# EAGLE design Gamer (EAGLE 7.1.0)

## Sheet 1 of 5
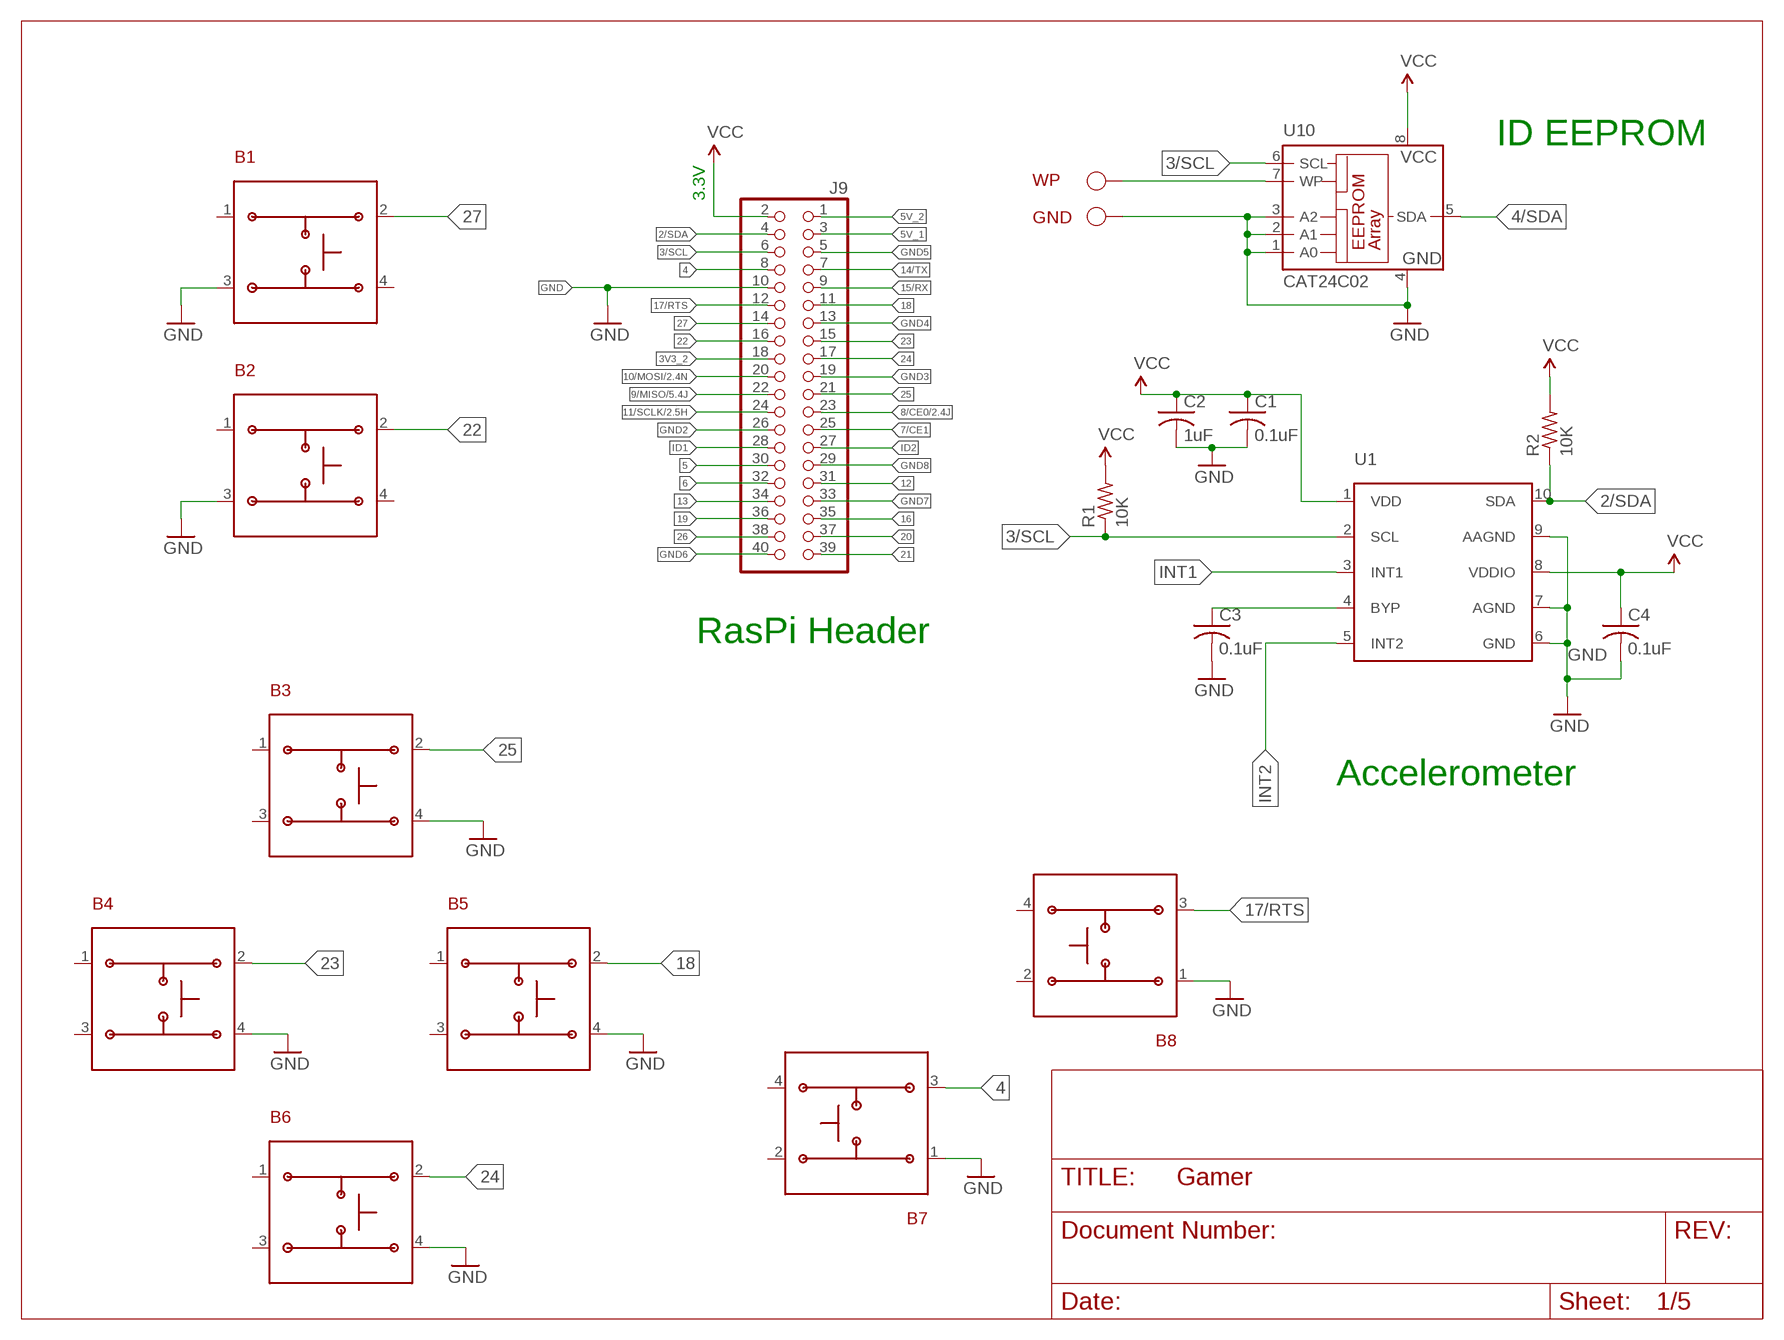
[diagram p0: schematic, sheet 1]

### Parts
B1  6X6MM_BUTTON  [6X6MM_BUTTON]
B2  6X6MM_BUTTON  [6X6MM_BUTTON]
B3  12X12MM_BUTTON  [12X12MM_BUTTON]
B4  12X12MM_BUTTON  [12X12MM_BUTTON]
B5  12X12MM_BUTTON  [12X12MM_BUTTON]
B6  12X12MM_BUTTON  [12X12MM_BUTTON]
B7  12X12MM_BUTTON  [12X12MM_BUTTON]
B8  12X12MM_BUTTON  [12X12MM_BUTTON]
C1  0.1uF  C-USC0603  [C0603]
C2  1uF  C-USC0603  [C0603]
C3  0.1uF  C-USC0603  [C0603]
C4  0.1uF  C-USC0603  [C0603]
GND  TESTPAD  [TESTPAD]
J9  PINHD-2X20  [2X20]
R1  10K  R-US_R0603  [R0603]
R2  10K  R-US_R0603  [R0603]
U1  MMA8653FCR1  [MMA8653FCR1]
U10  CAT24C02  24LC64ST  [TSSOP8]
WP  TESTPAD  [TESTPAD]

### Nets
2/SDA: J9.4 R2.1 U1.10(SDA)
3/SCL: J9.6 R1.1 U1.2(SCL) U10.6(SCL)
3V3_2: J9.18
4: B7.3 J9.8
4/SDA: U10.5(SDA)
5: J9.30
5V_1: J9.3
5V_2: J9.1
6: J9.32
7/CE1: J9.25
8/CE0: J9.23 ; also sheet 2,3,4,5
9/MISO: J9.22 ; also sheet 5
10/MOSI: J9.20 ; also sheet 2
11/SCLK: J9.24 ; also sheet 2,3,4,5
12: J9.31
13: J9.34
14/TX: J9.7
15/RX: J9.9
16: J9.35
17/RTS: B8.3 J9.12
18: B5.2 J9.11
19: J9.36
20: J9.37
21: J9.39
22: B2.2 J9.16
23: B4.2 J9.15
24: B6.2 J9.17
25: B3.2 J9.21
26: J9.38
27: B1.2 J9.14
GND: B1.3 B2.3 B3.4 B4.4 B5.4 B6.4 B7.1 B8.1 C1.2 C2.2 C3.2 C4.2 GND.1 J9.10 U1.6(GND) U1.7(AGND) U1.9(AAGND) U10.1(A0) U10.2(A1) U10.3(A2) U10.4(GND) ; also sheet 2,3,4,5
GND2: J9.26
GND3: J9.19
GND4: J9.13
GND5: J9.5
GND6: J9.40
GND7: J9.33
GND8: J9.29
ID1: J9.28
ID2: J9.27
INT1: U1.3(INT1)
INT2: U1.5(INT2)
N$1: U10.7(WP) WP.1
N$34: C3.1 U1.4(BYP)
VCC: C1.1 C2.1 C4.1 J9.2 R1.2 R2.2 U1.1(VDD) U1.8(VDDIO) U10.8(VCC) ; also sheet 2,3,4,5
Unconnected: B1.1 B1.4 B2.1 B2.4 B3.1 B3.3 B4.1 B4.3 B5.1 B5.3 B6.1 B6.3 B7.2 B7.4 B8.2 B8.4

### Notes on the sheet
- ID EEPROM
- 3.3V
- RasPi Header
- Accelerometer

## Sheet 2 of 5
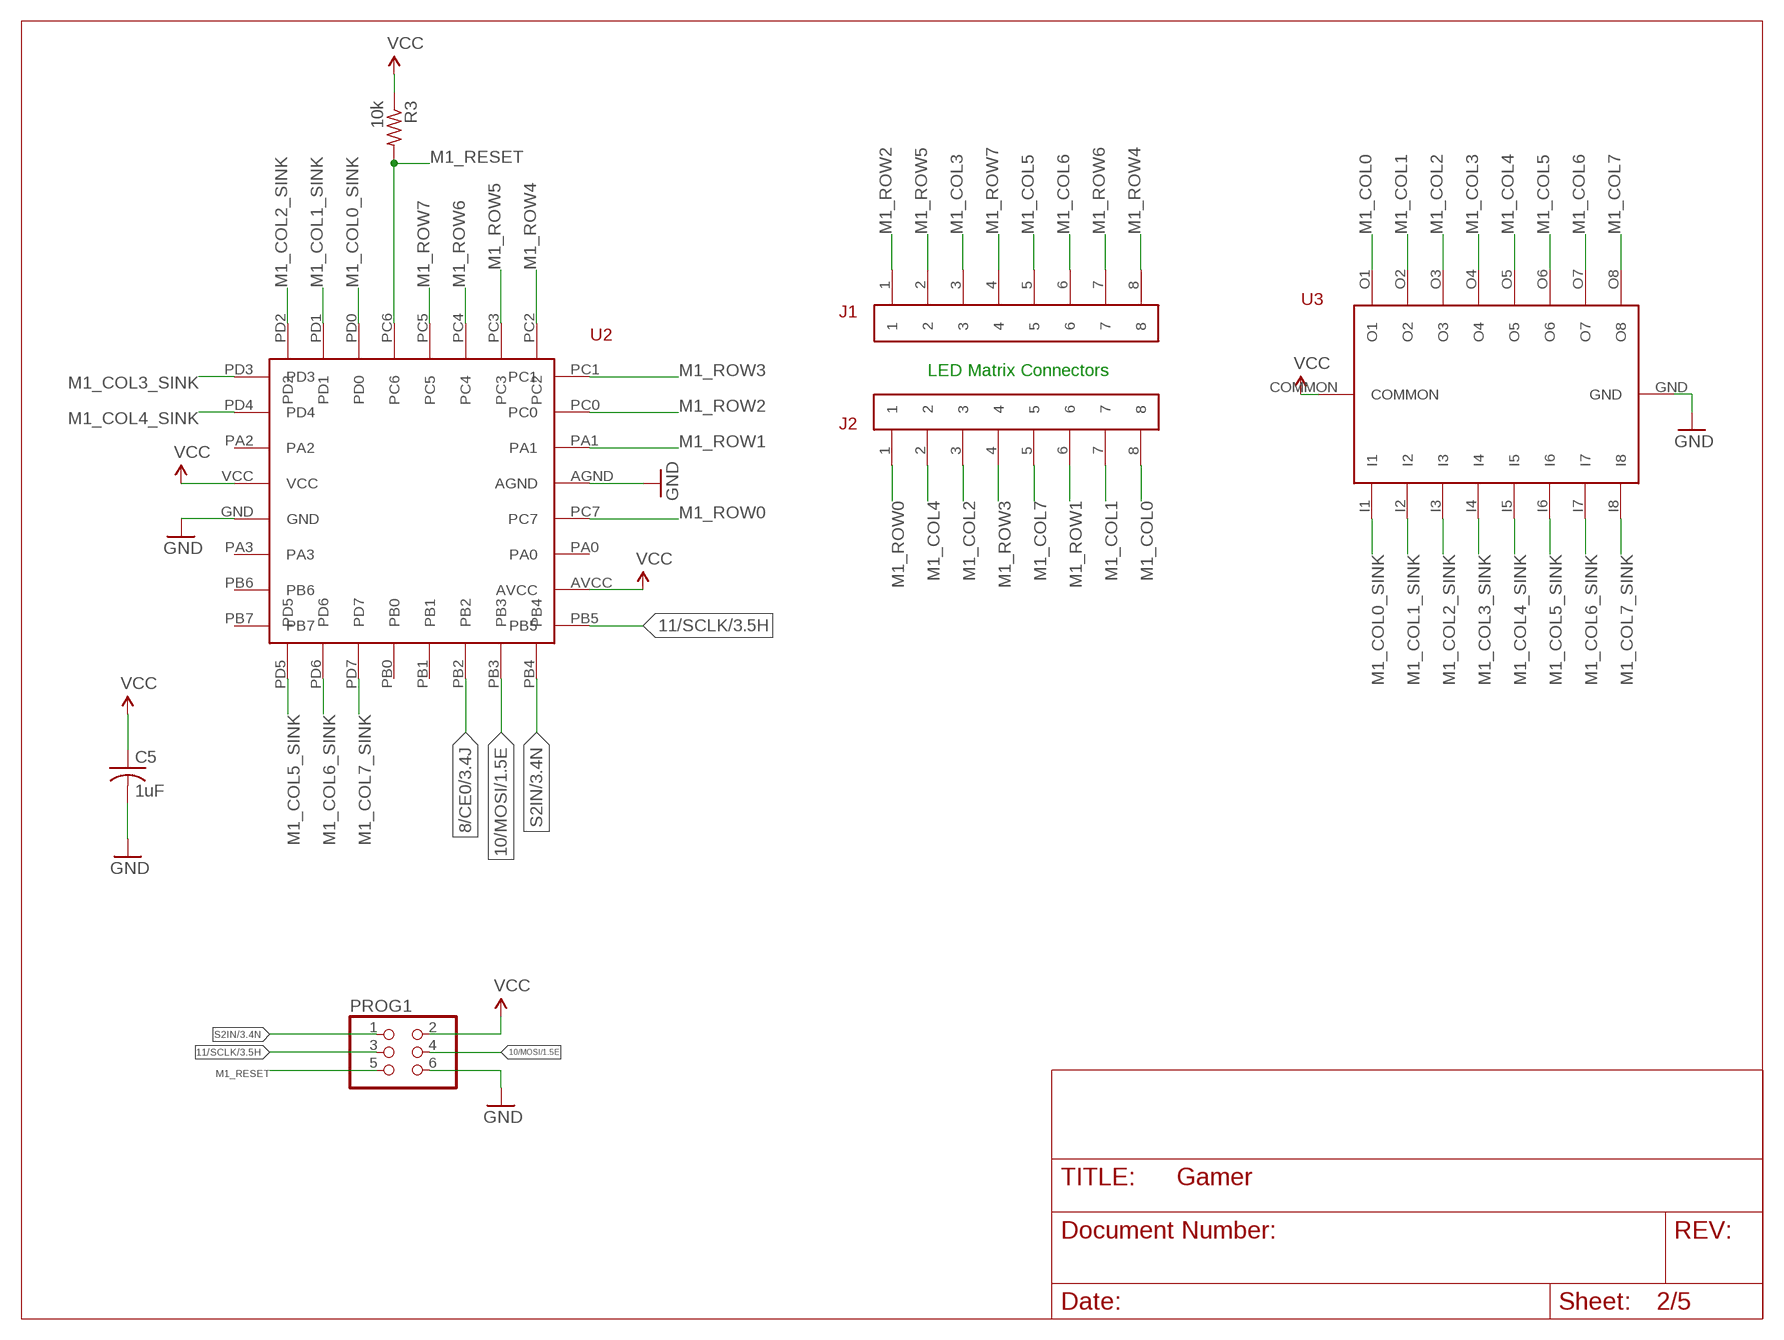
[diagram p1: schematic, sheet 2]

### Parts
C5  1uF  C-USC0603  [C0603]
J1  HEADER-1X8  [HEADER-1X8]
J2  HEADER-1X8  [HEADER-1X8]
PROG1  NONE  PINHD-2X3  [2X03]
R3  10k  R-US_R0603  [R0603]
U2  ATTINY48  [ATTINY48]
U3  ULN2803AFWG  [ULN2803AFWG]

### Nets
8/CE0: U2.PB2 ; also sheet 1,3,4,5
10/MOSI: PROG1.4 U2.PB3 ; also sheet 1
11/SCLK: PROG1.3 U2.PB5 ; also sheet 1,3,4,5
GND: C5.2 PROG1.6 U2.AGND U2.GND U3.GND ; also sheet 1,3,4,5
M1_COL0: J2.8 U3.O1
M1_COL0_SINK: U2.PD0 U3.I1
M1_COL1: J2.7 U3.O2
M1_COL1_SINK: U2.PD1 U3.I2
M1_COL2: J2.3 U3.O3
M1_COL2_SINK: U2.PD2 U3.I3
M1_COL3: J1.3 U3.O4
M1_COL3_SINK: U2.PD3 U3.I4
M1_COL4: J2.2 U3.O5
M1_COL4_SINK: U2.PD4 U3.I5
M1_COL5: J1.5 U3.O6
M1_COL5_SINK: U2.PD5 U3.I6
M1_COL6: J1.6 U3.O7
M1_COL6_SINK: U2.PD6 U3.I7
M1_COL7: J2.5 U3.O8
M1_COL7_SINK: U2.PD7 U3.I8
M1_RESET: PROG1.5 R3.2 U2.PC6
M1_ROW0: J2.1 U2.PC7
M1_ROW1: J2.6 U2.PA1
M1_ROW2: J1.1 U2.PC0
M1_ROW3: J2.4 U2.PC1
M1_ROW4: J1.8 U2.PC2
M1_ROW5: J1.2 U2.PC3
M1_ROW6: J1.7 U2.PC4
M1_ROW7: J1.4 U2.PC5
S2IN: PROG1.1 U2.PB4 ; also sheet 3
VCC: C5.1 PROG1.2 R3.1 U2.AVCC U2.VCC U3.COMMON ; also sheet 1,3,4,5
Unconnected: U2.PA0 U2.PA2 U2.PA3 U2.PB0 U2.PB1 U2.PB6 U2.PB7

### Notes on the sheet
- LED Matrix Connectors

## Sheet 3 of 5
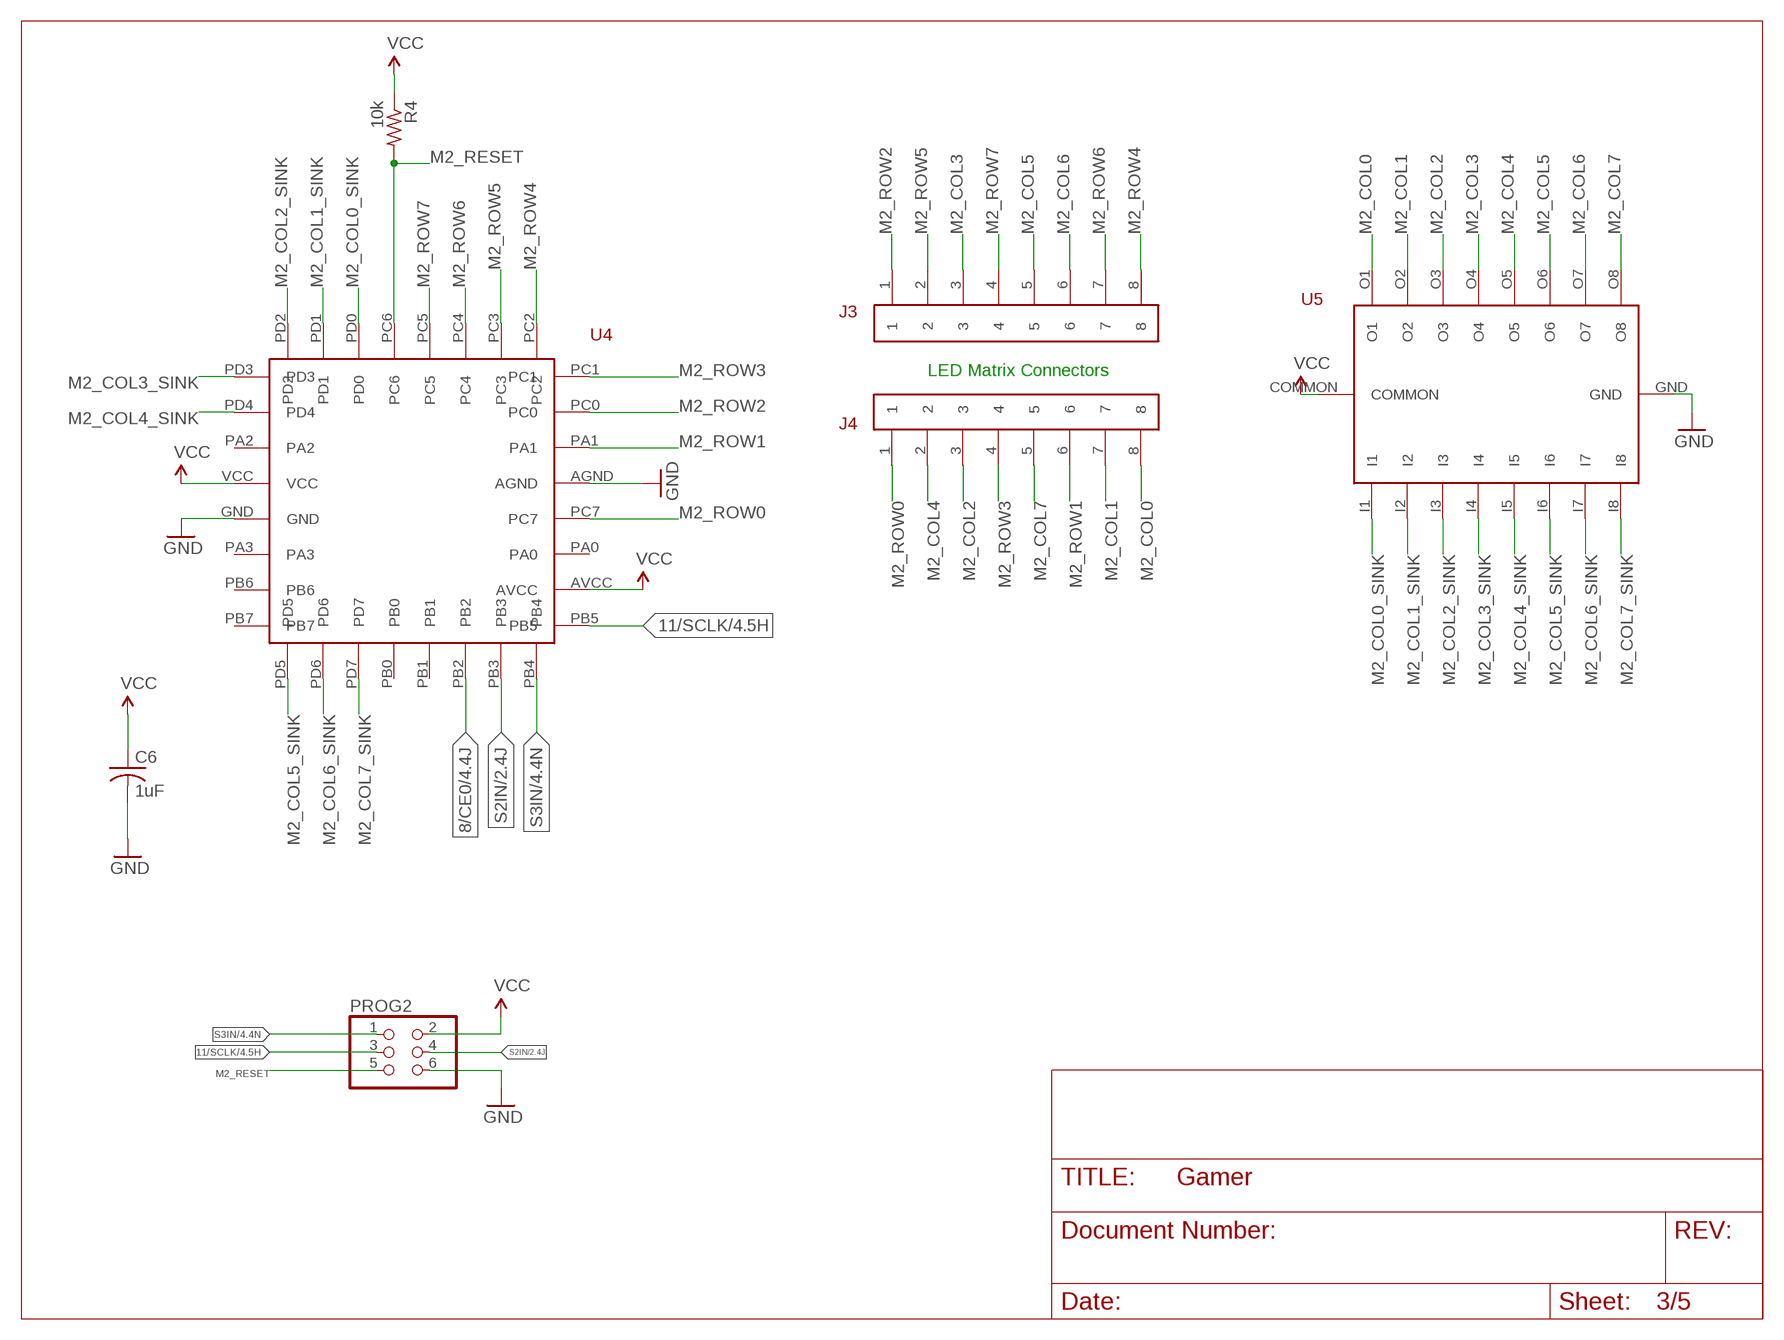
[diagram p2: schematic, sheet 3]

### Parts
C6  1uF  C-USC0603  [C0603]
J3  HEADER-1X8  [HEADER-1X8]
J4  HEADER-1X8  [HEADER-1X8]
PROG2  NONE  PINHD-2X3  [2X03]
R4  10k  R-US_R0603  [R0603]
U4  ATTINY48  [ATTINY48]
U5  ULN2803AFWG  [ULN2803AFWG]

### Nets
8/CE0: U4.PB2 ; also sheet 1,2,4,5
11/SCLK: PROG2.3 U4.PB5 ; also sheet 1,2,4,5
GND: C6.2 PROG2.6 U4.AGND U4.GND U5.GND ; also sheet 1,2,4,5
M2_COL0: J4.8 U5.O1
M2_COL0_SINK: U4.PD0 U5.I1
M2_COL1: J4.7 U5.O2
M2_COL1_SINK: U4.PD1 U5.I2
M2_COL2: J4.3 U5.O3
M2_COL2_SINK: U4.PD2 U5.I3
M2_COL3: J3.3 U5.O4
M2_COL3_SINK: U4.PD3 U5.I4
M2_COL4: J4.2 U5.O5
M2_COL4_SINK: U4.PD4 U5.I5
M2_COL5: J3.5 U5.O6
M2_COL5_SINK: U4.PD5 U5.I6
M2_COL6: J3.6 U5.O7
M2_COL6_SINK: U4.PD6 U5.I7
M2_COL7: J4.5 U5.O8
M2_COL7_SINK: U4.PD7 U5.I8
M2_RESET: PROG2.5 R4.2 U4.PC6
M2_ROW0: J4.1 U4.PC7
M2_ROW1: J4.6 U4.PA1
M2_ROW2: J3.1 U4.PC0
M2_ROW3: J4.4 U4.PC1
M2_ROW4: J3.8 U4.PC2
M2_ROW5: J3.2 U4.PC3
M2_ROW6: J3.7 U4.PC4
M2_ROW7: J3.4 U4.PC5
S2IN: PROG2.4 U4.PB3 ; also sheet 2
S3IN: PROG2.1 U4.PB4 ; also sheet 4
VCC: C6.1 PROG2.2 R4.1 U4.AVCC U4.VCC U5.COMMON ; also sheet 1,2,4,5
Unconnected: U4.PA0 U4.PA2 U4.PA3 U4.PB0 U4.PB1 U4.PB6 U4.PB7

### Notes on the sheet
- LED Matrix Connectors

## Sheet 4 of 5
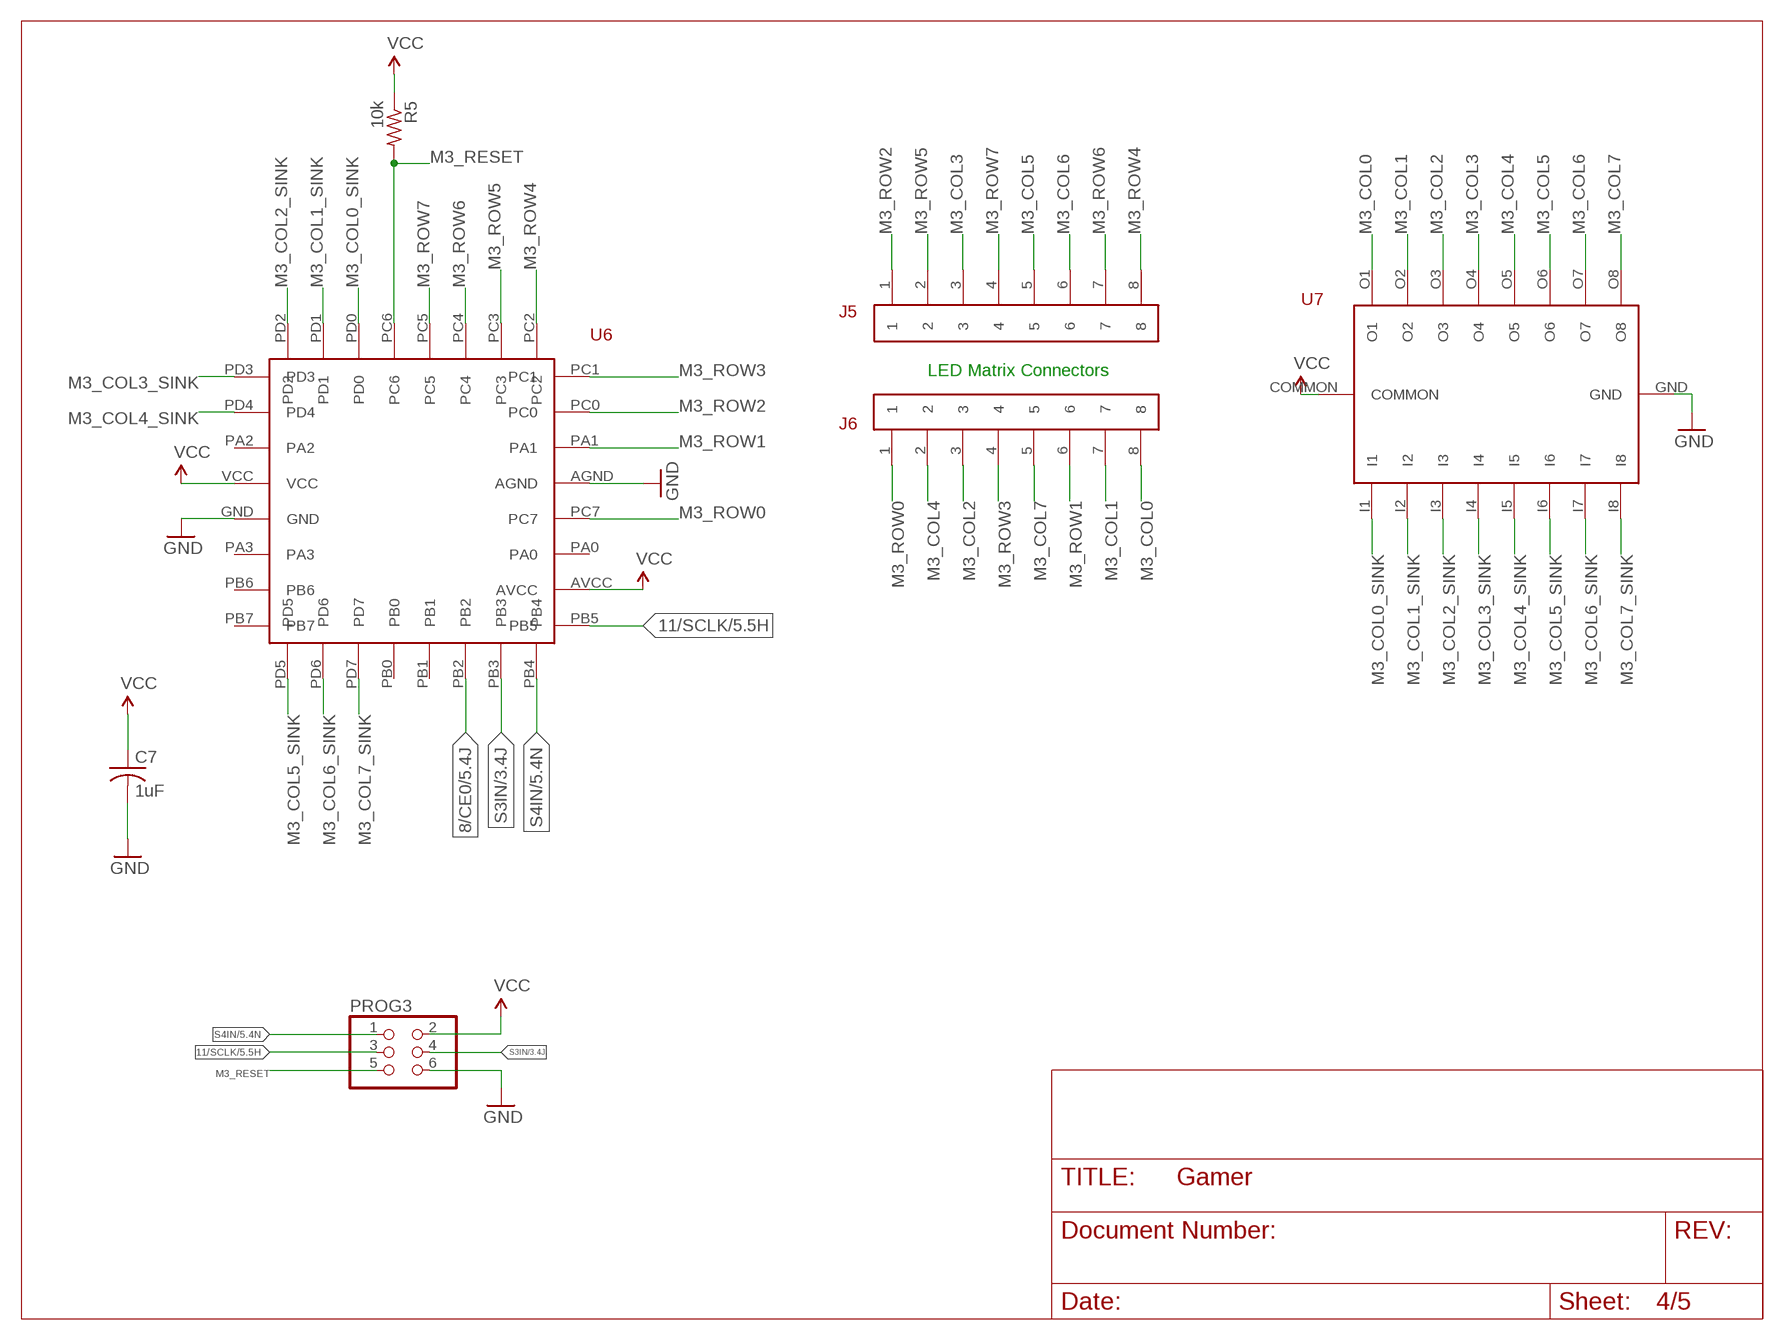
[diagram p3: schematic, sheet 4]

### Parts
C7  1uF  C-USC0603  [C0603]
J5  HEADER-1X8  [HEADER-1X8]
J6  HEADER-1X8  [HEADER-1X8]
PROG3  NONE  PINHD-2X3  [2X03]
R5  10k  R-US_R0603  [R0603]
U6  ATTINY48  [ATTINY48]
U7  ULN2803AFWG  [ULN2803AFWG]

### Nets
8/CE0: U6.PB2 ; also sheet 1,2,3,5
11/SCLK: PROG3.3 U6.PB5 ; also sheet 1,2,3,5
GND: C7.2 PROG3.6 U6.AGND U6.GND U7.GND ; also sheet 1,2,3,5
M3_COL0: J6.8 U7.O1
M3_COL0_SINK: U6.PD0 U7.I1
M3_COL1: J6.7 U7.O2
M3_COL1_SINK: U6.PD1 U7.I2
M3_COL2: J6.3 U7.O3
M3_COL2_SINK: U6.PD2 U7.I3
M3_COL3: J5.3 U7.O4
M3_COL3_SINK: U6.PD3 U7.I4
M3_COL4: J6.2 U7.O5
M3_COL4_SINK: U6.PD4 U7.I5
M3_COL5: J5.5 U7.O6
M3_COL5_SINK: U6.PD5 U7.I6
M3_COL6: J5.6 U7.O7
M3_COL6_SINK: U6.PD6 U7.I7
M3_COL7: J6.5 U7.O8
M3_COL7_SINK: U6.PD7 U7.I8
M3_RESET: PROG3.5 R5.2 U6.PC6
M3_ROW0: J6.1 U6.PC7
M3_ROW1: J6.6 U6.PA1
M3_ROW2: J5.1 U6.PC0
M3_ROW3: J6.4 U6.PC1
M3_ROW4: J5.8 U6.PC2
M3_ROW5: J5.2 U6.PC3
M3_ROW6: J5.7 U6.PC4
M3_ROW7: J5.4 U6.PC5
S3IN: PROG3.4 U6.PB3 ; also sheet 3
S4IN: PROG3.1 U6.PB4 ; also sheet 5
VCC: C7.1 PROG3.2 R5.1 U6.AVCC U6.VCC U7.COMMON ; also sheet 1,2,3,5
Unconnected: U6.PA0 U6.PA2 U6.PA3 U6.PB0 U6.PB1 U6.PB6 U6.PB7

### Notes on the sheet
- LED Matrix Connectors

## Sheet 5 of 5
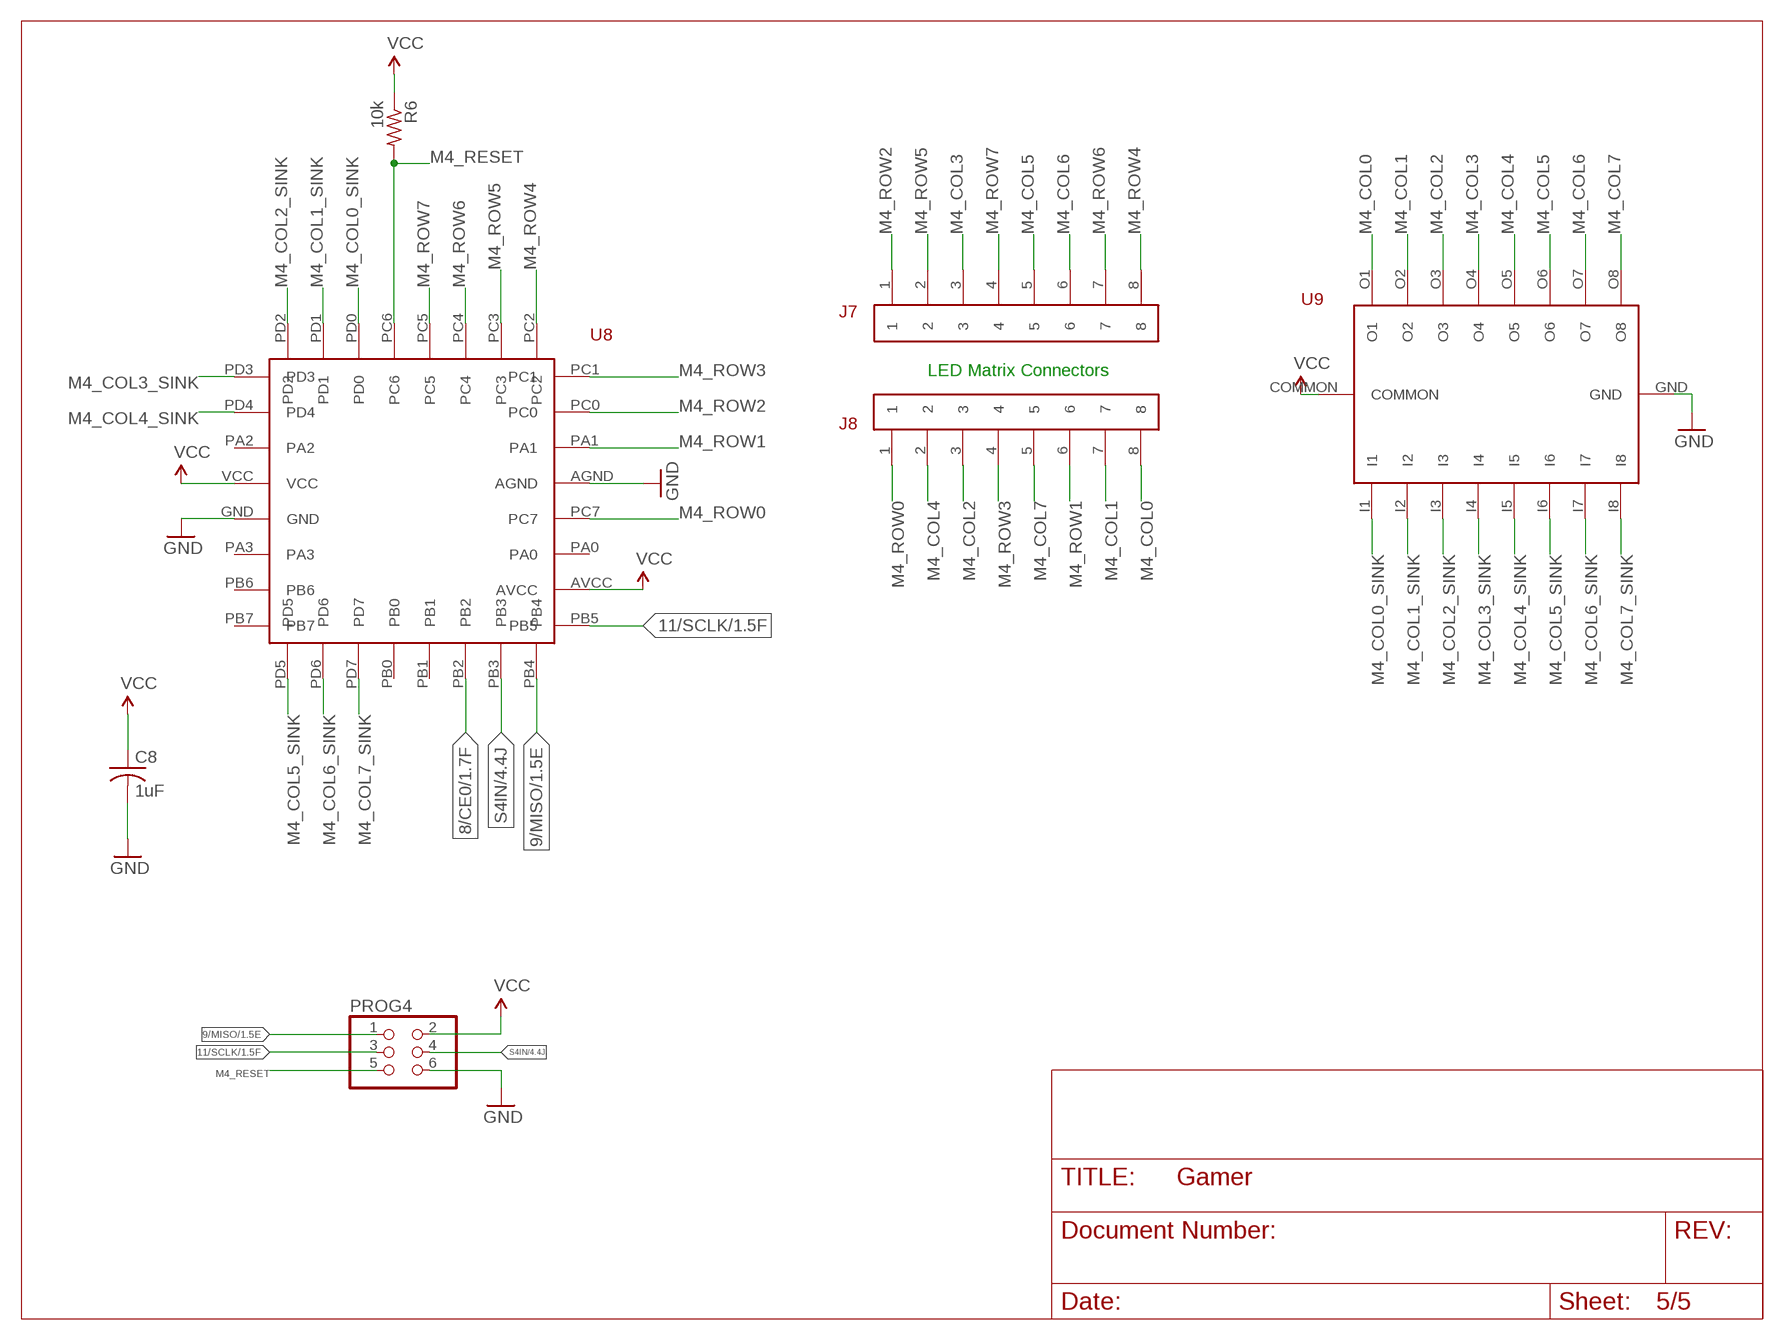
[diagram p4: schematic, sheet 5]

### Parts
C8  1uF  C-USC0603  [C0603]
J7  HEADER-1X8  [HEADER-1X8]
J8  HEADER-1X8  [HEADER-1X8]
PROG4  NONE  PINHD-2X3  [2X03]
R6  10k  R-US_R0603  [R0603]
U8  ATTINY48  [ATTINY48]
U9  ULN2803AFWG  [ULN2803AFWG]

### Nets
8/CE0: U8.PB2 ; also sheet 1,2,3,4
9/MISO: PROG4.1 U8.PB4 ; also sheet 1
11/SCLK: PROG4.3 U8.PB5 ; also sheet 1,2,3,4
GND: C8.2 PROG4.6 U8.AGND U8.GND U9.GND ; also sheet 1,2,3,4
M4_COL0: J8.8 U9.O1
M4_COL0_SINK: U8.PD0 U9.I1
M4_COL1: J8.7 U9.O2
M4_COL1_SINK: U8.PD1 U9.I2
M4_COL2: J8.3 U9.O3
M4_COL2_SINK: U8.PD2 U9.I3
M4_COL3: J7.3 U9.O4
M4_COL3_SINK: U8.PD3 U9.I4
M4_COL4: J8.2 U9.O5
M4_COL4_SINK: U8.PD4 U9.I5
M4_COL5: J7.5 U9.O6
M4_COL5_SINK: U8.PD5 U9.I6
M4_COL6: J7.6 U9.O7
M4_COL6_SINK: U8.PD6 U9.I7
M4_COL7: J8.5 U9.O8
M4_COL7_SINK: U8.PD7 U9.I8
M4_RESET: PROG4.5 R6.2 U8.PC6
M4_ROW0: J8.1 U8.PC7
M4_ROW1: J8.6 U8.PA1
M4_ROW2: J7.1 U8.PC0
M4_ROW3: J8.4 U8.PC1
M4_ROW4: J7.8 U8.PC2
M4_ROW5: J7.2 U8.PC3
M4_ROW6: J7.7 U8.PC4
M4_ROW7: J7.4 U8.PC5
S4IN: PROG4.4 U8.PB3 ; also sheet 4
VCC: C8.1 PROG4.2 R6.1 U8.AVCC U8.VCC U9.COMMON ; also sheet 1,2,3,4
Unconnected: U8.PA0 U8.PA2 U8.PA3 U8.PB0 U8.PB1 U8.PB6 U8.PB7

### Notes on the sheet
- LED Matrix Connectors

## Library data of the parts
B1 B2 = Gamer:6X6MM_BUTTON
B3-B8 = Gamer:12X12MM_BUTTON
C1-C4 = AccelBreakout:C-US: CAPACITOR, American symbol
C5-C8 = resistor:C-US: CAPACITOR, American symbol
GND WP = Gamer:TESTPAD
J1-J8 = LED_Matrix:HEADER-1X8
J9 = HeaderConnectorBoard:PINHD-2X20: PIN HEADER
PROG1-PROG4 = Gamer:PINHD-2X3: PIN HEADER
R1 R2 = AccelBreakout:R-US_: RESISTOR, American symbol
R3-R6 = resistor:R-US_: RESISTOR, American symbol
U1 = AccelBreakout:MMA8653FCR1
U2 U4 U6 U8 = LED_Matrix:ATTINY48
U3 U5 U7 U9 = LED_Matrix:ULN2803AFWG
U10 = microchip:24*: Serial EEPROM I2C; MF: MICROCHIP; MPN: 24LC64X-I/ST; OC_FARNELL: 1296582; OC_NEWARK: 96K4081

## Board
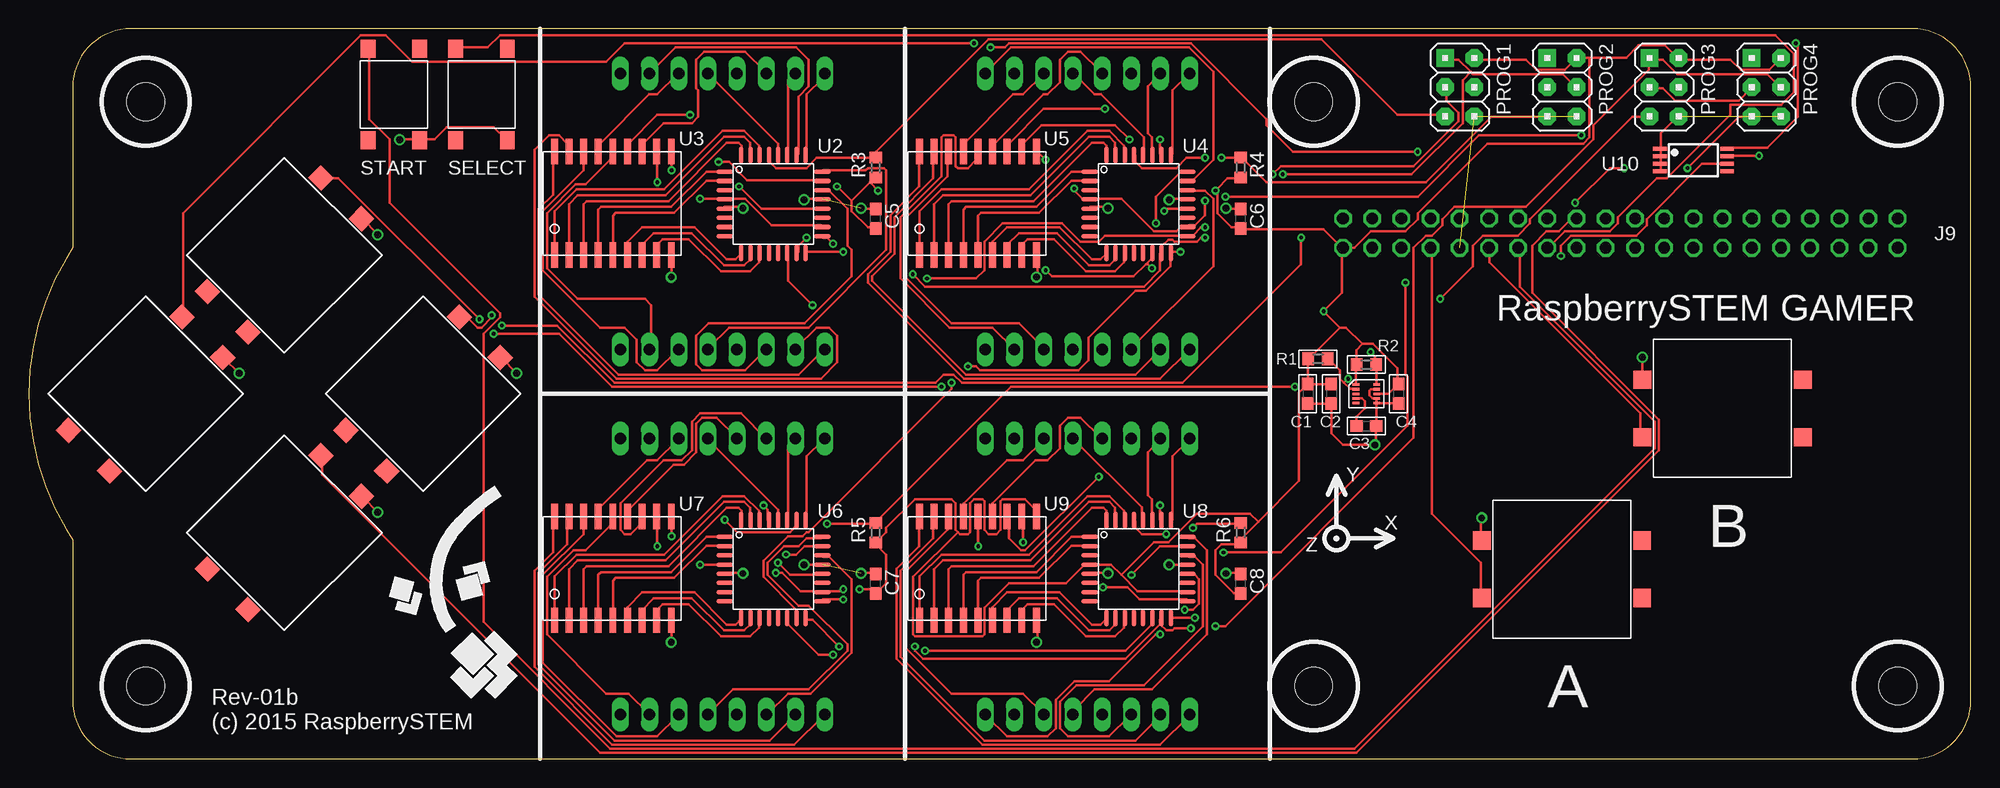
[diagram p5: board, top side]
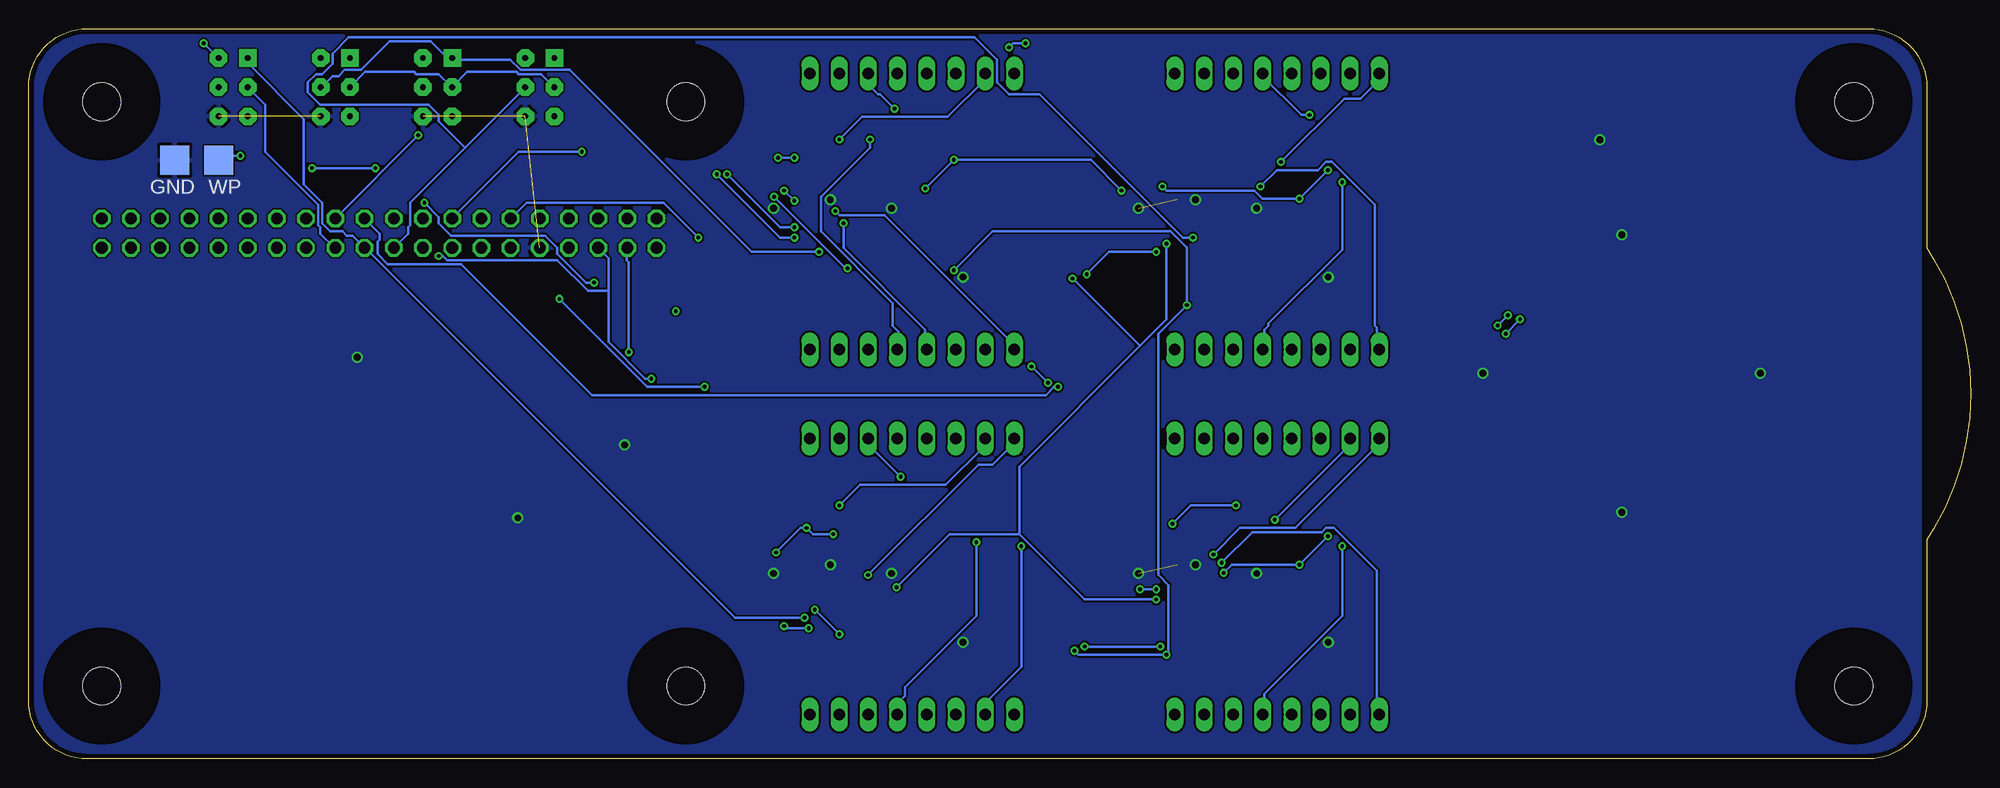
[diagram p6: board, bottom side, seen from below]

Size 168.92 x 63.5 mm. Coordinates in mm from the lower left corner, seen from the top.
Outline: 8.9,0 163.84,0 arc90 168.92,5.08 168.92,58.42 arc90 163.84,63.5 8.9,63.5 arc90 3.82,58.42 3.82,44.45 3.26,43.51 arc62 3.26,19.99 3.82,19.05 3.82,5.08 arc90 8.9,0
Copper layers (1*16): Top 0.0356mm / dielectric 1.5011mm / Bottom 0.0356mm
Design rules "LaenPCBOrder *": minimum track width 8mil, minimum drill 13mil, track to track 6mil, track to pad 6mil, pad to pad 6mil, via to via 6mil, smd to smd 6mil, copper to edge 15mil, drill to drill 6mil, minimum pad ring 7mil, minimum via ring 7mil, stop-mask expansion 3mil, vias tented up to drill 0mil, thermal gap 10mil
Holes 3.26 mm at 10.17,6.35 10.17,57.15 162.57,6.35 162.57,57.15 111.77,57.15 111.77,6.35
tRestrict: area 6.2,2.3 to 14.2,10.3; area 6.2,53.1 to 14.2,61.1; area 158.6,2.3 to 166.6,10.3; area 158.6,53.1 to 166.6,61.1; area 107.8,53.1 to 115.8,61.1; area 107.8,2.3 to 115.8,10.3
bRestrict: area 7.6,54.6 to 12.7,59.7; area 7.6,3.8 to 12.7,8.9; area 109.2,54.6 to 114.3,59.7; area 160,54.6 to 165.1,59.7; area 109.2,3.8 to 114.3,8.9; area 160,3.8 to 165.1,8.9
vRestrict: area 125.7,36.8 to 168.3,41.9

### Footprints (pad centres in the part's own frame; a part is rotated, then mirrored left to right if it is on the bottom)
6X6MM_BUTTON = smd 1.549 x 1.3: 1 -3.975,2.25; 2 3.975,2.25; 3 -3.975,-2.25; 4 3.975,-2.25
12X12MM_BUTTON = smd 1.55 x 1.6: 1 -6.975,2.5; 2 6.975,2.5; 3 -6.975,-2.5; 4 6.975,-2.5
C0603 = smd 1.1 x 1: 1 -0.85,0; 2 0.85,0
TESTPAD = smd 2.54 x 2.54: 1 0,0
HEADER-1X8 = drill 1 long: 1 -8.89,0; 2 -6.35,0; 3 -3.81,0; 4 -1.27,0; 5 1.27,0; 6 3.81,0; 7 6.35,0; 8 8.89,0
2X20 = drill 1.016 octagon: 1 -24.13,-1.27; 2 -24.13,1.27; 3 -21.59,-1.27; 4 -21.59,1.27; 5 -19.05,-1.27; 6 -19.05,1.27; 7 -16.51,-1.27; 8 -16.51,1.27; 9 -13.97,-1.27; 10 -13.97,1.27; 11 -11.43,-1.27; 12 -11.43,1.27; 13 -8.89,-1.27; 14 -8.89,1.27; 15 -6.35,-1.27; 16 -6.35,1.27; 17 -3.81,-1.27; 18 -3.81,1.27; 19 -1.27,-1.27; 20 -1.27,1.27; 21 1.27,-1.27; 22 1.27,1.27; 23 3.81,-1.27; 24 3.81,1.27; 25 6.35,-1.27; 26 6.35,1.27; 27 8.89,-1.27; 28 8.89,1.27; 29 11.43,-1.27; 30 11.43,1.27; 31 13.97,-1.27; 32 13.97,1.27; 33 16.51,-1.27; 34 16.51,1.27; 35 19.05,-1.27; 36 19.05,1.27; 37 21.59,-1.27; 38 21.59,1.27; 39 24.13,-1.27; 40 24.13,1.27
2X03 = drill 0.508 pad 1.524 square: 1 -2.54,-1.27 | drill 0.508 pad 1.524 octagon: 2 -2.54,1.27; 3 0,-1.27; 4 0,1.27; 5 2.54,-1.27; 6 2.54,1.27
R0603 = smd 1 x 1.1: 1 -0.85,0; 2 0.85,0
MMA8653FCR1 = smd 0.6 x 0.225: 1 -0.9,0.8; 2 -0.9,0.4; 3 -0.9,0; 4 -0.9,-0.4; 5 -0.9,-0.8; 6 0.9,-0.8; 7 0.9,-0.4; 8 0.9,0; 9 0.9,0.4; 10 0.9,0.8
ATTINY48 = smd 1.5 x 0.406: AGND 4.25,0.4; AVCC 4.25,-2; GND -4.25,-0.4; PA0 4.25,-1.2; PA1 4.25,1.2; PA2 -4.25,1.2; PA3 -4.25,-1.2; PB5 4.25,-2.8; PB6 -4.25,-2; PB7 -4.25,-2.8; PC0 4.25,2; PC1 4.25,2.8; PC7 4.25,-0.4; PD3 -4.25,2.8; PD4 -4.25,2; VCC -4.25,0.4 | smd 0.406 x 1.5: PB0 -0.4,-4.25; PB1 0.4,-4.25; PB2 1.2,-4.25; PB3 2,-4.25; PB4 2.8,-4.25; PC2 2.8,4.25; PC3 2,4.25; PC4 1.2,4.25; PC5 0.4,4.25; PC6 -0.4,4.25; PD0 -1.2,4.25; PD1 -2,4.25; PD2 -2.8,4.25; PD5 -2.8,-4.25; PD6 -2,-4.25; PD7 -1.2,-4.25
ULN2803AFWG = smd 0.6 x 2.2: COMMON 10.16,9.01; GND 10.16,0; I1 0,0; I2 1.27,0; I3 2.54,0; I4 3.81,0; I5 5.08,0; I6 6.35,0; I7 7.62,0; I8 8.89,0; O1 0,9.01; O2 1.27,9.01; O3 2.54,9.01; O4 3.81,9.01; O5 5.08,9.01; O6 6.35,9.01; O7 7.62,9.01; O8 8.89,9.01
TSSOP8 = smd 0.35 x 1.2: 1 -0.975,-2.925; 2 -0.325,-2.925; 3 0.325,-2.925; 4 0.975,-2.925; 5 0.975,2.925; 6 0.325,2.925; 7 -0.325,2.925; 8 -0.975,2.925

### Placement (x,y rotation side)
B1  31.76,57.78 90 top
B2  39.38,57.78 90 top
B3  22.24,43.81 45 top
B4  10.17,31.75 45 top
B5  34.3,31.75 45 top
B6  22.24,19.68 45 top
B7  133.36,16.51 0 top
B8  147.33,30.48 0 top
C1  111.26,31.75 270 top
C2  113.29,31.75 270 top
C3  116.34,28.96 0 top
C4  119.14,31.75 270 top
C5  73.67,46.99 90 top
C6  105.42,46.99 90 top
C7  73.67,15.24 90 top
C8  105.42,15.24 90 top
GND  156.22,52.07 0 bottom
J1  60.34,59.61 0 top
J2  60.34,35.61 0 top
J3  92.09,59.61 0 top
J4  92.09,35.61 0 top
J5  60.34,27.86 0 top
J6  60.34,3.86 0 top
J7  92.09,27.86 0 top
J8  92.09,3.86 0 top
J9  138.44,45.72 180 bottom
PROG1  124.47,58.42 270 top
PROG2  133.36,58.42 270 top
PROG3  142.25,58.42 270 top
PROG4  151.14,58.42 270 top
R1  112.15,34.8 180 top
R2  116.34,34.29 180 top
R3  73.67,51.44 90 top
R4  105.42,51.44 90 top
R5  73.67,19.68 90 top
R6  105.42,19.68 90 top
U1  116.34,31.75 0 top
U2  64.78,48.26 0 top
U3  45.73,43.81 0 top
U4  96.53,48.26 0 top
U5  77.48,43.81 0 top
U6  64.78,16.51 0 top
U7  45.73,12.06 0 top
U8  96.53,16.51 0 top
U9  77.48,12.06 0 top
U10  144.79,52.07 270 top
WP  152.41,52.07 0 bottom

### Tracks (layer width: path | path; a pad name or v marks a point on that pad's centre or on a via)
2/SDA  (via drill 0.33)
  Top 0.203: U1.10 117.24,34.24 R2.1 117.08,34.31 117.08,35.03 v116.72,35.38
  Bottom 0.203: v116.72,35.38 116.72,43.2 116.9,43.38 116.9,44.45 J9.4
3/SCL  (via drill 0.33)
  Top 0.203: 114.41,32.72 114.06,33.07 114.06,33.78 113.17,34.67 R1.1 | 114.41,32.72 114.95,32.18 115.3,32.18 U1.2 | v114.77,33.07 114.41,32.72 | v133.26,43.74 133.26,44.63 134.15,45.52 139.84,45.52 140.73,46.41 140.73,46.94 145.53,51.74 147.66,51.74 U10.6
  Bottom 0.203: v114.77,33.07 115.3,33.07 118.5,36.27 118.5,40.72 | 118.5,40.72 118.5,43.56 J9.6 | v133.26,43.74 132.9,43.74 132.55,43.38 122.95,43.38 120.28,40.72 118.5,40.72
4
  Top 0.203: B7.3 126.32,14.05 126.32,17.07 122.06,21.34 122.06,44.45 J9.8
8/CE0  (via drill 0.33)
  Top 0.203: v69.96,9.07 68.72,9.07 66.05,11.73 66.05,12.09 U6.PB2 | v77.96,9.42 95.39,9.42 97.7,11.73 97.7,12.09 U8.PB2 | v68.18,39.47 66.05,41.6 66.05,43.92 U2.PB2 | 97.17,43.03 96.1,41.96 88.99,41.96 v88.45,42.49 | 97.17,43.03 97.7,43.56 97.7,43.92 U4.PB2 | v135.04,54.23 126.15,54.23 120.81,48.9 v104.1,48.9 | v97.7,42.67 97.34,43.03 97.17,43.03
  Bottom 0.203: v77.96,9.42 77.61,9.07 v69.96,9.07 69.78,9.25 69.78,15.11 70.67,16 70.67,36.98 v68.18,39.47 68.18,44.45 69.61,45.87 85.08,45.87 v88.45,42.49 | v135.04,54.23 142.15,47.12 J9.23 | v104.1,48.9 97.88,42.67 v97.7,42.67
9/MISO  (via drill 0.33)
  Top 0.203: v101.43,12.27 99.48,12.27 U8.PB4
  Bottom 0.203: v101.43,12.27 107.48,12.27 139.66,44.45 | 139.66,44.45 140.73,45.52 141.26,45.52 141.62,45.87 142.68,45.87 143.39,46.58 143.39,48.36 144.99,49.96 144.99,55.65 149.79,60.45 149.79,60.81 PROG4.1 | 139.66,44.45 J9.22
10/MOSI  (via drill 0.33)
  Top 0.203: v67.65,45.34 66.94,44.63 66.94,44.09 U2.PB3
  Bottom 0.203: J9.20 135.93,45.7 135.93,46.23 135.75,46.41 135.75,48.36 130.95,53.16 | 130.95,53.16 125.79,58.32 PROG1.4 | v67.65,45.34 68.54,45.34 80.99,57.78 83.65,57.78 84.72,58.85 84.72,60.81 86.68,62.76 141.08,62.76 142.5,61.34 142.5,60.45 143.39,59.56 143.93,59.56 144.64,58.85 144.64,57.96 143.57,56.9 134.15,56.9 133.26,56.01 133.26,55.47 130.95,53.16
11/SCLK  (via drill 0.33)
  Top 0.203: v70.85,13.87 69.07,13.87 U6.PB5 | v93.43,14.94 95.57,14.94 96.63,13.87 100.72,13.87 U8.PB5 | v69.96,44.81 69.43,45.34 69.07,45.34 U2.PB5 | v78.14,41.78 82.41,41.78 83.12,42.49 83.12,44.98 84.72,46.58 89.88,46.58 91.48,44.98 93.08,44.98 93.61,45.52 100.72,45.52 U4.PB5 100.9,45.52 101.25,45.52 101.97,46.23 v102.32,46.23 | PROG3.3 141.08,58.32 142.15,58.32 143.22,57.25 148.73,57.25 149.79,58.32 PROG4.3 | v108.19,50.85 108.9,51.56 120.46,51.56 124.37,55.47 124.37,56.19 123.3,57.25 123.3,58.32 PROG1.3
  Bottom 0.203: v70.85,13.87 77.07,13.87 82.76,19.56 | 82.76,19.56 88.81,19.56 v93.43,14.94 | v69.96,44.81 69.96,38.23 72.27,35.92 | 72.27,35.92 82.76,25.43 82.76,19.56 | 72.27,35.92 v78.14,41.78 | PROG1.3 123.3,58.5 124.37,59.56 126.32,59.56 126.5,59.74 130.77,59.74 PROG2.3 132.19,58.5 133.26,59.56 135.21,59.56 135.39,59.74 139.66,59.74 PROG3.3 | J9.24 142.33,44.45 143.57,45.7 143.57,46.23 143.75,46.41 143.75,48.18 148.37,52.81 148.37,56.9 149.79,58.32 PROG4.3 | v108.19,50.85 103.57,46.23 v102.32,46.23
17/RTS
  Top 0.203: B8.3 140.19,28.09 140.19,30.05 127.04,43.2 127.04,44.45 J9.12
18  (via drill 0.33)
  Top 0.203: v40.27,38.58 40.27,38.41 39.38,37.52 39.02,37.52 38.14,38.41 37.6,38.41 B5.2 | v41.16,37.69 45.96,37.69 50.94,32.72 78.85,32.72 79.56,33.43 80.45,33.43 81.16,32.72 100.37,32.72 110.68,43.03 v110.68,45.34
  Bottom 0.203: v41.16,37.69 v40.27,38.58 | v110.68,45.34 113.7,48.36 125.61,48.36 126.86,47.12 J9.11
22
  Top 0.203: B2.2 37.25,61.87 39.91,61.87 40.98,62.94 151.93,62.94 153.53,61.34 153.53,57.96 152.46,56.9 148.02,56.9 148.02,56.01 142.5,50.49 141.62,50.49 138.24,47.12 138.24,46.58 137.53,45.87 133.61,45.87 132.19,44.45 J9.16
23  (via drill 0.33)
  Top 0.203: v82.23,62.23 51.83,62.23 50.23,60.63 33.34,60.63 31.02,62.94 28.89,62.94 13.42,47.47 13.42,38.58 B4.2 | v83.65,61.87 84.9,61.87 85.25,62.23 101.08,62.23 107.66,55.65 107.66,55.12 109.97,52.81 v120.81,52.81
  Bottom 0.203: v82.23,62.23 83.3,62.23 v83.65,61.87 | v120.81,52.81 126.32,52.81 132.01,47.12 J9.15
24
  Top 0.203: B6.2 25.51,26.31 25.51,24.71 49.69,0.53 115.48,0.53 141.79,26.85 141.79,29.52 130.77,40.54 130.77,44.63 132.01,45.87 133.08,45.87 134.15,46.94 134.5,46.94 J9.17
25  (via drill 0.33)
  Top 0.203: v39.2,38.23 26.93,50.49 25.51,50.49 B3.2 | v40.45,36.98 46.14,36.98 50.76,32.36 v79.39,32.36
  Bottom 0.203: v40.45,36.98 v39.2,38.23 | v79.39,32.36 79.74,32.36 80.45,31.65 119.92,31.65 131.3,43.03 137.7,43.03 138.59,43.92 138.59,44.98 138.42,45.16 138.42,45.7 J9.21
27
  Top 0.203: B1.2 29.6,61.7 29.6,55.65 31.38,53.87 31.38,48.36 40.98,38.76 40.98,38.41 39.56,36.98 39.56,11.91 50.58,0.89 115.3,0.89 141.44,27.03 141.44,29.34 129.7,41.07 129.7,44.45 J9.14
GND  (via drill 0.6)  (5 unrouted)
  Top 0.203: U1.9 116.74,32.15 116.6,32 116.6,31.62 116.87,31.35 U1.7 U1.6 | U1.6 119.09,30.95 C4.2 | U1.6 117.24,29.01 C3.2 117.19,27.6 v117.1,27.3 114.31,27.3 113.29,28.32 C2.2 C1.2 | B2.3 41.51,53.87 40.45,54.94 36.36,54.94 35.29,53.87 34.05,53.87 B1.3 33.87,53.87 32.27,53.87 v32.27,53.85 | C7.2 73.52,16.18 72.45,16.18 v72.4,16.13 | C5.2 73.52,47.83 72.45,47.83 v72.4,47.88 | C8.2 105.34,16.18 104.28,16.18 v104.15,16.13 | C6.2 105.34,47.83 104.28,47.83 v104.15,47.88 | U6.GND 60.54,16.18 61.96,16.18 v62.11,16.13 | v67.45,16.89 68.9,16.89 U6.AGND | U8.GND 92.36,16.18 93.79,16.18 v93.86,16.13 | U2.GND 60.54,48.01 61.96,48.01 v62.11,47.88 | v99.2,16.89 100.72,16.89 U8.AGND | U2.AGND 68.9,48.72 67.47,48.72 v67.45,48.64 | U4.GND 92.36,48.01 93.79,48.01 v93.86,47.88 | U4.AGND 100.72,48.72 99.3,48.72 v99.2,48.64 | v30.36,21.46 29.07,22.76 B6.4 | v18.3,33.53 16.98,34.85 B4.4 | B3.4 29.07,46.94 30.31,45.7 v30.36,45.59 | B5.4 41.16,34.85 42.4,33.6 v42.43,33.53 | B7.1 126.32,19.02 126.32,20.8 v126.38,20.95 | B8.1 140.37,33.07 140.37,34.85 v140.35,34.92 | U7.GND 55.92,11.91 55.92,10.31 v55.89,10.16 | U9.GND 87.74,11.91 87.74,10.31 v87.64,10.16 | U3.GND 55.92,43.74 55.92,41.96 v55.89,41.91 | U5.GND 87.74,43.74 87.74,41.96 v87.64,41.91 | U10.4 141.97,51.21 141.97,51.74 U10.3 141.97,51.92 141.97,52.27 U10.2 141.97,52.45 141.97,52.98 U10.1 141.97,53.16 141.97,54.41 143.39,55.83 PROG3.6
  pour Bottom: 13.35,0.64 163.84,0.64 arc90 168.29,5.08 168.29,58.42 arc90 163.84,62.87 8.9,62.87 arc90 4.46,58.42 4.46,5.08 arc90 8.9,0.64
M1_COL0
  Top 0.203: U3.O1 45.6,52.81 45.6,49.07 44.36,47.83 44.36,40.36 51.29,33.43 66.94,33.43 69.07,35.56 J2.8
M1_COL0_SINK
  Top 0.203: U3.I1 45.73,47.62 47.64,49.53 55.26,49.53 60.34,54.61 62.24,54.61 63.51,53.34 63.51,52.58 U2.PD0
M1_COL1
  Top 0.203: U3.O2 46.85,52.98 46.85,53.52 46.14,54.23 45.25,54.23 44,52.98 44,40.18 51.12,33.07 68.9,33.07 70.32,34.49 70.32,36.8 69.61,37.52 68.54,37.52 66.76,35.74 J2.7
M1_COL1_SINK
  Top 0.203: U3.I2 47,48.26 47.76,49.02 55.38,49.02 60.46,54.1 62.24,54.1 62.75,53.59 62.75,52.54 U2.PD1
M1_COL2
  Top 0.203: U3.O3 48.27,51.21 44.71,47.65 44.71,42.49 49.69,37.52 51.83,37.52 52.89,36.45 52.89,34.49 53.6,33.78 54.67,33.78 56.45,35.56 J2.3
M1_COL2_SINK
  Top 0.203: U3.I3 48.27,48.26 48.52,48.51 55.64,48.51 60.72,53.59 61.73,53.59 61.99,53.34 U2.PD2
M1_COL3
  Top 0.203: U3.O4 49.69,52.98 49.69,53.52 53.96,57.78 54.67,57.78 56.45,59.56 J1.3
M1_COL3_SINK
  Top 0.203: U3.I4 49.54,47.75 49.79,48.01 55.89,48.01 58.94,51.05 U2.PD3
M1_COL4
  Top 0.203: U3.O5 50.76,52.81 50.76,52.27 48.45,49.96 47.56,49.96 45.07,47.47 45.07,42.67 47.74,40.01 53.6,40.01 54.14,39.47 54.14,35.74 J2.2
M1_COL4_SINK
  Top 0.203: U3.I5 50.81,47.24 51.06,47.5 56.14,47.5 58.94,50.29 60.5,50.29 U2.PD4
M1_COL5  (via drill 0.33)
  Top 0.203: v57.52,56.01 54.67,56.01 52.18,53.52 52.18,52.98 U3.O6
  Bottom 0.203: v57.52,56.01 58.23,56.01 61.61,59.38 J1.5
M1_COL5_SINK
  Top 0.203: U2.PD5 61.98,43.94 61.48,43.43 60.72,43.43 57.92,46.23 53.35,46.23 52.08,44.96 U3.I6
M1_COL6
  Top 0.203: U3.O7 53.43,52.98 53.43,53.52 55.2,55.3 57.69,55.3 58.23,55.83 58.23,58.14 58.05,58.32 58.05,60.81 58.76,61.52 62.32,61.52 64.09,59.74 J1.6
M1_COL6_SINK
  Top 0.203: U2.PD6 62.78,43.47 62.24,42.93 60.46,42.93 57.67,45.72 54.37,45.72 53.35,44.7 U3.I7
M1_COL7  (via drill 0.33)
  Top 0.203: v54.67,50.14 54.67,52.81 U3.O8
  Bottom 0.203: v54.67,50.14 54.67,44.27 61.07,37.87 61.07,37.69 61.43,37.34 61.43,35.92 61.61,35.74 J2.5
M1_COL7_SINK
  Top 0.203: U3.I8 54.62,44.7 55.13,45.21 57.41,45.21 60.21,42.42 62.75,42.42 63.51,43.18 63.51,43.94 U2.PD7
M1_RESET
  Top 0.203: U2.PC6 64.45,52.45 64.45,51.92 64.98,51.38 67.65,51.38 68.54,52.27 73.52,52.27 R3.2 73.7,52.45 73.7,52.81 83.47,62.59 112.46,62.59 119.03,56.01 123.12,56.01 PROG1.5
M1_ROW0  (via drill 0.33)
  Top 0.203: v61.78,49.78 63.74,47.83 68.9,47.83 U2.PC7
  Bottom 0.203: v61.78,49.78 60.36,51.21 56.8,51.21 56.09,51.92 55.56,51.92 51.83,48.18 51.83,37.69 51.65,37.52 51.65,37.16 51.47,36.98 51.47,35.74 J2.1
M1_ROW1
  Top 0.203: J2.6 62.32,33.78 58.58,33.78 58.05,34.31 58.05,36.8 59.12,37.87 67.47,37.87 71.56,41.96 71.56,44.27 71.21,44.63 71.21,47.83 69.61,49.43 69.07,49.43 U2.PA1
M1_ROW2  (via drill 0.33)
  Top 0.203: v60.01,51.92 60.89,51.92 62.49,50.32 68.9,50.32 U2.PC0
  Bottom 0.203: v60.01,51.92 54.49,57.43 53.07,57.43 51.47,59.03 51.47,59.56 J1.1
M1_ROW3
  Top 0.203: U2.PC1 69.07,51.21 72.81,51.21 72.98,51.38 74.41,51.38 74.58,51.21 74.58,44.27 67.83,37.52 60.89,37.52 59.12,35.74 J2.4
M1_ROW4
  Top 0.203: U2.PC2 67.65,52.63 67.65,57.78 69.07,59.21 69.07,59.56 J1.8
M1_ROW5
  Top 0.203: U2.PC3 66.94,52.63 66.94,57.61 67.83,58.5 67.83,60.81 66.76,61.87 56.27,61.87 54.14,59.74 J1.2
M1_ROW6
  Top 0.203: U2.PC4 66.05,52.63 66.05,59.03 66.58,59.56 J1.7
M1_ROW7
  Top 0.203: J1.4 65.16,53.52 65.16,52.63 U2.PC5
M2_COL0
  Top 0.203: U5.O1 77.43,52.81 77.43,49.78 74.94,47.3 74.94,44.09 72.98,42.14 72.98,41.43 81.34,33.07 98.41,33.07 100.9,35.56 J4.8
M2_COL0_SINK
  Top 0.203: U5.I1 77.48,47.62 79.39,49.53 87.01,49.53 92.09,54.61 93.99,54.61 95.26,53.34 95.26,52.58 U4.PD0
M2_COL1
  Top 0.203: U5.O2 78.67,52.81 78.67,50.49 75.3,47.12 75.3,43.92 73.34,41.96 73.34,41.6 81.52,33.43 96.28,33.43 98.41,35.56 J4.7
M2_COL1_SINK
  Top 0.203: U5.I2 78.75,48.26 79.51,49.02 87.13,49.02 92.21,54.1 93.99,54.1 94.5,53.59 94.5,52.54 U4.PD1
M2_COL2
  Top 0.203: U5.O3 79.92,52.81 79.92,50.67 76.19,46.94 76.19,41.96 80.27,37.87 86.14,37.87 88.28,35.74 J4.3
M2_COL2_SINK
  Top 0.203: U5.I3 80.02,48.26 80.27,48.51 87.39,48.51 92.47,53.59 93.48,53.59 93.74,53.34 U4.PD2
M2_COL3
  Top 0.203: U5.O4 81.34,52.98 81.34,53.52 85.61,57.78 86.5,57.78 88.28,59.56 J3.3
M2_COL3_SINK
  Top 0.203: U5.I4 81.29,47.75 81.54,48.01 87.64,48.01 90.69,51.05 U4.PD3
M2_COL4
  Top 0.203: J4.2 83.83,37.52 80.1,37.52 75.83,41.78 75.83,47.12 79.39,50.67 79.39,54.05 79.56,54.23 80.45,54.23 80.63,54.05 80.63,51.56 80.81,51.38 81.7,51.38 82.41,52.09 82.41,52.81 U5.O5
M2_COL4_SINK
  Top 0.203: U5.I5 82.56,47.24 82.81,47.5 87.89,47.5 90.69,50.29 92.25,50.29 U4.PD4
M2_COL5
  Top 0.203: U5.O6 83.83,53.34 88.28,57.78 88.63,57.78 89.7,58.85 89.7,60.81 90.41,61.52 91.48,61.52 93.25,59.74 J3.5
M2_COL5_SINK
  Top 0.203: U4.PD5 93.73,43.94 93.23,43.43 92.47,43.43 89.67,46.23 85.1,46.23 83.83,44.96 U5.I6
M2_COL6  (via drill 0.33)
  Top 0.203: v93.61,56.54 88.28,56.54 85.25,53.52 85.25,52.98 U5.O7
  Bottom 0.203: v93.61,56.54 94.85,57.78 95.03,57.78 95.74,58.5 95.74,59.56 J3.6
M2_COL6_SINK
  Top 0.203: U4.PD6 94.53,43.47 93.99,42.93 92.21,42.93 89.42,45.72 86.12,45.72 85.1,44.7 U5.I7
M2_COL7  (via drill 0.33)
  Top 0.203: v95.74,53.87 94.5,55.12 88.1,55.12 86.5,53.52 86.5,52.98 U5.O8
  Bottom 0.203: v95.74,53.87 95.74,53.16 100.01,48.9 100.01,45.87 93.79,39.65 93.79,37.69 93.25,37.16 93.25,35.74 J4.5
M2_COL7_SINK
  Top 0.203: U5.I8 86.37,44.7 86.88,45.21 89.16,45.21 91.96,42.42 94.5,42.42 95.26,43.18 95.26,43.94 U4.PD7
M2_RESET  (via drill 0.33)
  Top 0.203: v102.32,52.27 100.72,52.27 99.83,51.38 96.81,51.38 96.28,51.92 96.28,52.45 U4.PC6 | v103.74,52.27 105.34,52.27 R4.2 105.52,52.27 107.66,50.14 121.52,50.14 127.21,55.83 132.01,55.83 PROG2.5
  Bottom 0.203: v103.74,52.27 v102.32,52.27
M2_ROW0  (via drill 0.33)
  Top 0.203: v98.77,47.65 98.94,47.83 100.72,47.83 U4.PC7
  Bottom 0.203: v98.77,47.65 98.41,47.3 94.5,47.3 83.3,36.09 83.3,35.74 J4.1
M2_ROW1
  Top 0.203: U4.PA1 100.9,49.43 102.32,49.43 103.03,48.72 103.03,42.85 95.92,35.74 J4.6
M2_ROW2
  Top 0.203: U4.PC0 100.9,50.32 101.25,50.32 103.03,52.09 103.03,59.74 100.9,61.87 85.43,61.87 83.3,59.74 J3.1
M2_ROW3  (via drill 0.33)
  Top 0.203: v98.05,46.58 98.05,48.9 100.19,51.03 100.72,51.03 U4.PC1
  Bottom 0.203: v98.05,46.58 98.05,44.45 90.94,37.34 90.94,35.74 J4.4
M2_ROW4
  Top 0.203: U4.PC2 99.48,52.63 99.48,58.14 100.9,59.56 J3.8
M2_ROW5  (via drill 0.33)
  Top 0.203: v98.41,53.87 98.41,52.63 U4.PC3
  Bottom 0.203: v98.41,53.87 96.45,55.83 88.99,55.83 85.79,59.03 85.79,59.56 J3.2
M2_ROW6
  Top 0.203: U4.PC4 97.7,52.63 97.7,54.05 97.34,54.41 97.34,58.5 98.41,59.56 J3.7
M2_ROW7
  Top 0.203: U4.PC5 96.99,52.63 96.99,54.05 93.25,57.78 92.72,57.78 90.94,59.56 J3.4
M3_COL0
  Top 0.203: U7.O1 45.6,20.98 45.6,17.96 44,16.36 44,8 50.76,1.25 66.58,1.25 69.07,3.73 J6.8
M3_COL0_SINK
  Top 0.203: U7.I1 45.73,15.88 47.64,17.78 55.26,17.78 60.34,22.86 62.24,22.86 63.51,21.59 63.51,20.83 U6.PD0
M3_COL1
  Top 0.203: U7.O2 46.85,20.98 46.85,18.67 44.36,16.18 44.36,8.18 50.94,1.6 64.45,1.6 66.58,3.73 J6.7
M3_COL1_SINK
  Top 0.203: U7.I2 47,16.51 47.76,17.27 55.38,17.27 60.46,22.35 62.24,22.35 62.75,21.84 62.75,20.79 U6.PD1
M3_COL2
  Top 0.203: U7.O3 48.27,19.56 44.71,16 44.71,8.36 51.12,1.96 54.67,1.96 56.45,3.73 J6.3
M3_COL2_SINK
  Top 0.203: U7.I3 48.27,16.51 48.52,16.76 55.64,16.76 60.72,21.84 61.73,21.84 61.99,21.59 U6.PD2
M3_COL3
  Top 0.203: U7.O4 49.69,21.16 49.69,21.87 53.78,25.96 54.67,25.96 56.45,27.74 J5.3
M3_COL3_SINK
  Top 0.203: U7.I4 49.54,16 49.79,16.26 55.89,16.26 58.94,19.3 U6.PD3
M3_COL4
  Top 0.203: U7.O5 50.76,20.98 50.76,20.45 48.45,18.14 47.38,18.14 45.07,15.82 45.07,10.85 50.23,5.69 52.18,5.69 53.96,3.91 J6.2
M3_COL4_SINK
  Top 0.203: U7.I5 50.81,15.49 51.06,15.75 56.14,15.75 58.94,18.54 60.5,18.54 U6.PD4
M3_COL5
  Top 0.203: U7.O6 52.18,21.16 52.18,21.69 56.09,25.6 56.98,25.6 58.05,26.67 58.05,29.16 58.58,29.69 59.83,29.69 61.61,27.91 J5.5
M3_COL5_SINK
  Top 0.203: U6.PD5 61.98,12.19 61.48,11.68 60.72,11.68 57.92,14.48 53.35,14.48 52.08,13.21 U7.I6
M3_COL6
  Top 0.203: J5.6 61.96,30.05 58.41,30.05 57.69,29.34 57.69,26.85 56.8,25.96 55.2,25.96 51.47,22.23 51.47,19.91 51.83,19.56 52.36,19.56 53.25,20.45 53.25,20.98 U7.O7
M3_COL6_SINK
  Top 0.203: U6.PD6 62.78,11.72 62.24,11.18 60.46,11.18 57.67,13.97 54.37,13.97 53.35,12.95 U7.I7
M3_COL7  (via drill 0.33)
  Top 0.203: v54.67,18.49 54.67,20.98 U7.O8
  Bottom 0.203: v54.67,18.49 54.67,12.45 61.43,5.69 61.43,4.09 61.61,3.91 J6.5
M3_COL7_SINK
  Top 0.203: 54.62,11.43 U7.I8 | U7.I8 54.62,12.09 | 54.62,12.09 54.62,12.95 55.13,13.46 57.41,13.46 60.21,10.67 62.75,10.67 63.51,11.43 63.51,12.19 U6.PD7 | U7.I8 54.67,12.09 54.62,12.09
M3_RESET  (via drill 0.33)
  Top 0.203: v63.92,22.05 64.27,21.69 64.27,20.8 U6.PC6 | v69.43,20.45 73.52,20.45 R5.2 73.7,20.62 85.43,32.36 v110.14,32.36 | v122.77,40.01 125.61,42.85 125.61,44.63 126.5,45.52 129.53,45.52 130.59,46.58 130.59,46.94 139.48,55.83 140.9,55.83 PROG3.5
  Bottom 0.203: v63.92,22.05 67.83,22.05 v69.43,20.45 | v122.77,40.01 115.12,32.36 v110.14,32.36
M3_ROW0  (via drill 0.33)
  Top 0.203: v65.16,17.07 66.23,16 68.9,16 U6.PC7
  Bottom 0.203: v65.16,17.07 62.49,19.74 56.45,19.74 56.09,20.09 55.38,20.09 51.65,16.36 51.65,4.09 51.47,3.91 J6.1
M3_ROW1
  Top 0.203: U6.PA1 69.07,17.6 69.61,17.6 71.56,15.65 71.56,9.25 68.01,5.69 66.05,5.69 64.27,3.91 J6.6
M3_ROW2  (via drill 0.33)
  Top 0.203: v65.87,17.78 66.76,17.78 67.47,18.49 68.9,18.49 U6.PC0
  Bottom 0.203: v65.87,17.78 63.56,20.09 58.76,20.09 51.47,27.38 51.47,27.74 J5.1
M3_ROW3
  Top 0.203: J6.4 61.25,6.04 67.83,6.04 71.21,9.42 71.21,9.96 67.83,13.34 66.94,13.34 64.27,16 64.27,17.07 65.69,18.49 66.94,18.49 67.65,19.2 68.9,19.2 U6.PC1
M3_ROW4
  Top 0.203: U6.PC2 67.65,20.8 67.65,26.31 69.07,27.74 J5.8
M3_ROW5  (via drill 0.33)
  Top 0.203: v60.54,20.8 61.61,19.74 66.23,19.74 66.76,20.27 66.76,20.62 U6.PC3
  Bottom 0.203: v60.54,20.8 54.14,27.2 54.14,27.74 J5.2
M3_ROW6
  Top 0.203: U6.PC4 66.05,20.8 66.05,27.2 66.58,27.74 J5.7
M3_ROW7
  Top 0.203: U6.PC5 65.16,20.8 65.16,21.69 59.12,27.74 J5.4
M4_COL0
  Top 0.203: U9.O1 77.43,20.98 77.43,18.49 75.47,16.54 75.47,8.71 82.94,1.25 98.41,1.25 100.9,3.73 J8.8
M4_COL0_SINK
  Top 0.203: U9.I1 77.48,15.88 79.39,17.78 87.01,17.78 92.09,22.86 93.99,22.86 95.26,21.59 95.26,20.83 U8.PD0
M4_COL1
  Top 0.203: U9.O2 78.67,20.98 78.67,19.2 75.83,16.36 75.83,8.89 83.12,1.6 96.28,1.6 98.41,3.73 J8.7
M4_COL1_SINK
  Top 0.203: U9.I2 78.75,16.51 79.51,17.27 87.13,17.27 92.21,22.35 93.99,22.35 94.5,21.84 94.5,20.79 U8.PD1
M4_COL2
  Top 0.203: U9.O3 79.92,20.98 79.92,19.91 76.19,16.18 76.19,9.78 80.27,5.69 86.5,5.69 88.28,3.91 J8.3
M4_COL2_SINK
  Top 0.203: U9.I3 80.02,16.51 80.27,16.76 87.39,16.76 92.47,21.84 93.48,21.84 93.74,21.59 U8.PD2
M4_COL3
  Top 0.203: U9.O4 81.34,21.16 81.34,22.23 85.08,25.96 86.5,25.96 88.28,27.74 J7.3
M4_COL3_SINK
  Top 0.203: U9.I4 81.29,16 81.54,16.26 87.64,16.26 90.69,19.3 U8.PD3
M4_COL4  (via drill 0.33)
  Top 0.203: v82.59,18.49 82.59,20.98 U9.O5
  Bottom 0.203: v82.59,18.49 82.59,8 85.61,4.98 85.61,3.91 J8.2
M4_COL4_SINK
  Top 0.203: U9.I5 82.56,15.49 82.81,15.75 87.89,15.75 90.69,18.54 92.25,18.54 U8.PD4
M4_COL5
  Top 0.203: U9.O6 83.83,22.23 87.56,25.96 88.63,25.96 89.7,27.03 89.7,28.98 90.41,29.69 91.48,29.69 93.25,27.91 J7.5
M4_COL5_SINK
  Top 0.203: U8.PD5 93.73,12.19 93.23,11.68 92.47,11.68 89.67,14.48 85.1,14.48 83.83,13.21 U9.I6
M4_COL6  (via drill 0.33)
  Top 0.203: v93.08,24.54 86.68,18.14 86.32,18.14 85.25,19.2 85.25,20.98 U9.O7
  Bottom 0.203: v93.08,24.54 95.74,27.2 95.74,27.74 J7.6
M4_COL6_SINK
  Top 0.203: U8.PD6 94.53,11.72 93.99,11.18 92.21,11.18 89.42,13.97 86.12,13.97 85.1,12.95 U9.I7
M4_COL7  (via drill 0.33)
  Top 0.203: v86.5,18.85 86.5,20.98 U9.O8
  Bottom 0.203: v86.5,18.85 86.5,12.45 92.72,6.22 92.72,5.51 93.25,4.98 93.25,3.91 J8.5
M4_COL7_SINK
  Top 0.203: U9.I8 86.37,12.95 86.88,13.46 89.16,13.46 91.96,10.67 94.5,10.67 95.26,11.43 95.26,12.19 U8.PD7
M4_RESET  (via drill 0.33)
  Top 0.203: v101.25,20.09 101.61,20.45 105.34,20.45 R6.2 | v98.94,19.56 96.81,19.56 96.28,20.09 96.28,20.62 U8.PC6 | v144.28,51.38 148.73,55.83 149.79,55.83 PROG4.5 | v138.77,51.38 137.53,51.38 v134.5,48.36 | v119.75,41.43 119.75,33.43 119.92,33.25 119.92,28.98 108.9,17.96 v103.92,17.96
  Bottom 0.203: v98.94,19.56 100.72,19.56 v101.25,20.09 101.79,20.09 v103.92,17.96 | v138.77,51.38 v144.28,51.38 | v134.5,48.36 133.26,47.12 133.26,46.58 132.19,45.52 124.01,45.52 122.95,44.45 122.95,43.92 120.46,41.43 v119.75,41.43
M4_ROW0  (via drill 0.33)
  Top 0.203: v100.54,12.98 101.25,12.98 101.79,13.51 101.79,15.65 101.43,16 100.9,16 U8.PC7 | v98.41,10.85 98.05,10.85 93.97,6.76 90.94,6.76 89.34,5.16 89.34,2.67 88.63,1.96 85.08,1.96 83.3,3.73 J8.1
  Bottom 0.203: v98.41,10.85 v100.54,12.98
M4_ROW1
  Top 0.203: U8.PA1 100.9,17.6 101.43,17.6 102.14,16.89 102.14,11.56 96.99,6.4 91.12,6.4 89.7,4.98 89.7,2.67 90.41,1.96 93.97,1.96 95.74,3.73 J8.6
M4_ROW2  (via drill 0.33)
  Top 0.203: v95.92,16 98.41,18.49 100.72,18.49 U8.PC0
  Bottom 0.203: v95.92,16 86.32,25.6 85.08,25.6 83.3,27.38 83.3,27.74 J7.1
M4_ROW3
  Top 0.203: U8.PC1 100.9,19.2 101.43,19.2 102.5,18.14 102.5,10.85 97.7,6.04 92.72,6.04 90.94,4.27 90.94,3.91 J8.4
M4_ROW4
  Top 0.203: U8.PC2 99.48,20.8 99.48,26.31 100.9,27.74 J7.8
M4_ROW5  (via drill 0.33)
  Top 0.203: v98.41,22.05 98.41,20.8 U8.PC3
  Bottom 0.203: v98.41,22.05 96.63,23.82 89.16,23.82 85.79,27.2 85.79,27.74 J7.2
M4_ROW6
  Top 0.203: U8.PC4 97.7,20.8 97.7,22.58 97.34,22.94 97.34,26.67 98.41,27.74 J7.7
M4_ROW7
  Top 0.203: J7.4 96.81,21.87 96.81,20.8 U8.PC5
N$1  (via drill 0.33)
  Top 0.203: v150.51,52.45 147.84,52.45 U10.7
  Bottom 0.203: v150.51,52.45 151.93,52.45 152.28,52.09 WP.1
N$34
  Top 0.203: C3.1 115.49,29.76 116.22,30.48 116.22,31.11 115.98,31.35 U1.4
S2IN  (via drill 0.33)
  Top 0.203: v70.85,44.09 67.65,44.09 U2.PB4 | v76.9,42.14 77.96,41.07 96.99,41.07 98.41,42.49 98.41,43.92 U4.PB3 98.59,44.09 98.59,44.63 99.12,45.16 99.48,45.16 99.65,44.98 101.61,44.98 101.97,45.34 v102.32,45.34 | 125.44,59.74 125.61,59.56 133.44,59.56 134.5,58.5 PROG2.4 | 125.44,59.74 124.37,60.81 123.3,60.81 PROG1.1 | 125.44,59.74 124.72,59.03 124.72,55.3 120.28,50.85 v109.08,50.85
  Bottom 0.203: v70.85,44.09 74.94,44.09 v76.9,42.14 | v109.08,50.85 103.57,45.34 v102.32,45.34
S3IN  (via drill 0.33)
  Top 0.203: v80.27,32.72 80.27,32.18 67.83,19.74 67.65,19.74 67.3,19.38 66.05,19.38 63.92,17.25 63.92,15.82 66.76,12.98 66.76,12.27 U6.PB3 | v81.7,34.14 82.41,34.14 82.76,33.78 91.3,33.78 92.19,34.67 92.19,36.63 96.28,40.72 97.17,40.72 99.3,42.85 99.3,43.92 U4.PB4 99.48,44.09 v100.19,44.09
  Bottom 0.203: PROG3.4 143.39,58.5 142.5,59.38 141.97,59.38 141.44,59.92 140.02,59.92 137.53,62.41 133.97,62.41 132.55,60.98 132.19,60.98 PROG2.1 132.01,60.81 127.04,60.81 126.15,59.92 121.88,59.92 106.06,44.09 v100.19,44.09 | v81.7,34.14 v80.27,32.72
S4IN  (via drill 0.33)
  Top 0.203: PROG4.4 152.28,58.5 151.22,59.56 143.39,59.56 142.15,60.81 141.08,60.81 PROG3.1 140.9,60.81 140.9,59.92 136.1,55.12 136.1,53.87 130.24,48.01 124.01,48.01 122.95,46.94 122.95,46.41 122.06,45.52 121.52,45.52 120.46,44.45 120.46,27.91 104.1,11.56 v103.21,11.56 | v70.5,9.78 68.18,12.09 67.65,12.09 U6.PB4 | v77.07,9.78 77.07,9.42 77.79,8.71 95.39,8.71 98.41,11.73 | 98.41,11.73 98.41,12.09 U8.PB3 98.41,11.73 | v101.08,11.38 99.65,11.38 99.48,11.2 98.94,11.2 98.41,11.73
  Bottom 0.203: v77.07,9.78 v70.5,9.78 | v103.21,11.56 103.03,11.38 v101.08,11.38
VCC  (via drill 0.33)
  Top 0.203: U1.1 115.44,34.24 R2.2 115.48,34.31 115.48,35.56 116.01,36.09 | C2.1 C1.1 | C1.1 111.26,34.76 R1.2 111.39,34.85 114.06,37.52 | U1.8 118.29,31.75 C4.1 119.03,32.72 119.03,33.96 116.9,36.09 116.01,36.09 | v55.92,19.38 55.92,20.98 U7.COMMON | 80.81,19.74 80.63,19.91 80.63,22.23 80.27,22.58 77.07,22.58 74.58,20.09 74.58,19.74 73.7,18.85 R5.1 73.7,18.67 74.58,17.78 74.58,15.29 73.7,14.4 C7.1 73.52,14.4 73.16,14.76 v72.27,14.76 | 80.81,19.74 80.99,19.56 81.7,19.56 81.87,19.74 81.87,22.23 82.23,22.58 82.94,22.58 83.12,22.4 83.12,19.91 83.47,19.56 84.19,19.56 84.54,19.91 84.54,22.4 84.72,22.58 86.68,22.58 87.56,21.69 87.56,21.16 U9.COMMON | 95.03,16 96.45,14.58 100.72,14.58 U8.AVCC | 95.03,16 94.14,16.89 92.36,16.89 U8.VCC 92.19,16.89 91.83,16.89 90.23,15.29 85.25,15.29 83.12,13.16 83.12,10.85 82.94,10.67 77.07,10.67 76.9,10.85 76.9,15.82 80.81,19.74 | C8.1 105.34,14.4 104.81,14.4 103.21,16 103.21,18.14 103.74,18.67 105.34,18.67 R6.1 105.52,18.85 105.52,19.2 106.94,20.62 | 106.94,20.62 110.5,24.18 110.5,31.83 111.21,32.54 C1.1 | 95.03,16 97.88,18.85 99.12,18.85 101.61,21.34 106.23,21.34 106.94,20.62 | v58.41,16.89 60.36,16.89 U6.VCC | v70.85,14.76 70.67,14.58 69.07,14.58 U6.AVCC 68.9,14.58 67.12,14.58 65.52,16.18 v64.98,16.18 | v88.45,52.09 87.74,52.81 U5.COMMON | v90.94,49.61 90.94,49.43 91.65,48.72 92.19,48.72 U4.VCC 92.36,48.72 95.03,48.72 97.88,45.87 99.83,45.87 100.19,46.23 100.72,46.23 U4.AVCC 100.9,46.41 101.43,46.41 102.32,47.3 v102.32,48.54 | 71.56,48.54 71.56,47.65 72.98,46.23 73.52,46.23 C5.1 | 73.16,50.14 73.52,50.49 R3.1 73.16,50.14
  Top 0.203: 73.16,50.14 71.56,48.54 | U2.AVCC 68.9,46.41 64.63,46.41 62.32,48.72 60.54,48.72 U2.VCC 60.36,48.72 v58.41,48.72 | v55.92,51.21 55.92,52.81 U3.COMMON | v70.32,49.78 71.56,48.54 | 73.16,50.14 v73.87,49.43 | 103.39,49.61 104.28,50.49 105.34,50.49 R4.1 | 116.01,36.09 114.59,37.52 114.06,37.52 | 114.06,37.52 v112.63,38.94 114.23,40.54 114.23,44.45 | 103.39,49.61 103.39,47.47 104.63,46.23 105.34,46.23 C6.1 105.52,46.05 112.63,46.05 114.23,44.45 | 103.39,49.61 v103.21,49.43 | 114.23,44.45 J9.2 115.3,44.45 116.72,45.87 119.75,45.87 120.81,46.94 120.81,47.47 126.86,53.52 135.21,53.52 135.75,54.05 135.75,60.98 | PROG1.2 125.79,60.81 130.24,60.81 131.13,59.92 133.61,59.92 134.5,60.81 PROG2.2 134.68,60.98 135.75,60.98 | PROG4.2 152.28,60.81 151.39,59.92 148.91,59.92 148.02,60.81 143.57,60.81 PROG3.2 143.39,60.98 142.33,62.05 140.02,62.05 138.95,60.98 135.75,60.98 | v153.71,62.23 153.88,62.05 153.88,55.83 151.22,53.16 147.84,53.16 U10.8
  Bottom 0.203: v55.92,19.38 v58.41,16.89 64.27,16.89 v64.98,16.18 | v72.27,14.76 v70.85,14.76 | v90.94,49.61 v88.45,52.09 76.54,52.09 v73.87,49.43 | v55.92,51.21 v58.41,48.72 61.61,48.72 62.32,49.43 69.96,49.43 v70.32,49.78 | v102.32,48.54 v103.21,49.43 | v153.71,62.23 152.46,60.98 PROG4.2

### Text on the board
tPlace: START | SELECT | RaspberrySTEM GAMER | Y | X | Z | B | A | Rev-01b / (c) 2015 RaspberrySTEM